# Altium project RegistrationModule.PrjPCB (part 2 of 4)

## Sheet DigitalPart.SchDoc: Плата АЦП - общая часть
size 330 x 381 mm; PageSetup: Record=PageOptions|CenterHorizontal=True|CenterVertical=True|PrintScale=0.82|XCorrection=1.00|YCorrection=1.00|PrintKind=2|BorderSize=5000000|LeftOffset=0|BottomOffset=0|Orientation=1|PaperLength=1000|PaperWidth=1000|Scale=100|PaperSource=7|PrintQuality=-4|MediaType=1|DitherType=10|PaperKind=A3|PrintScaleMode=1
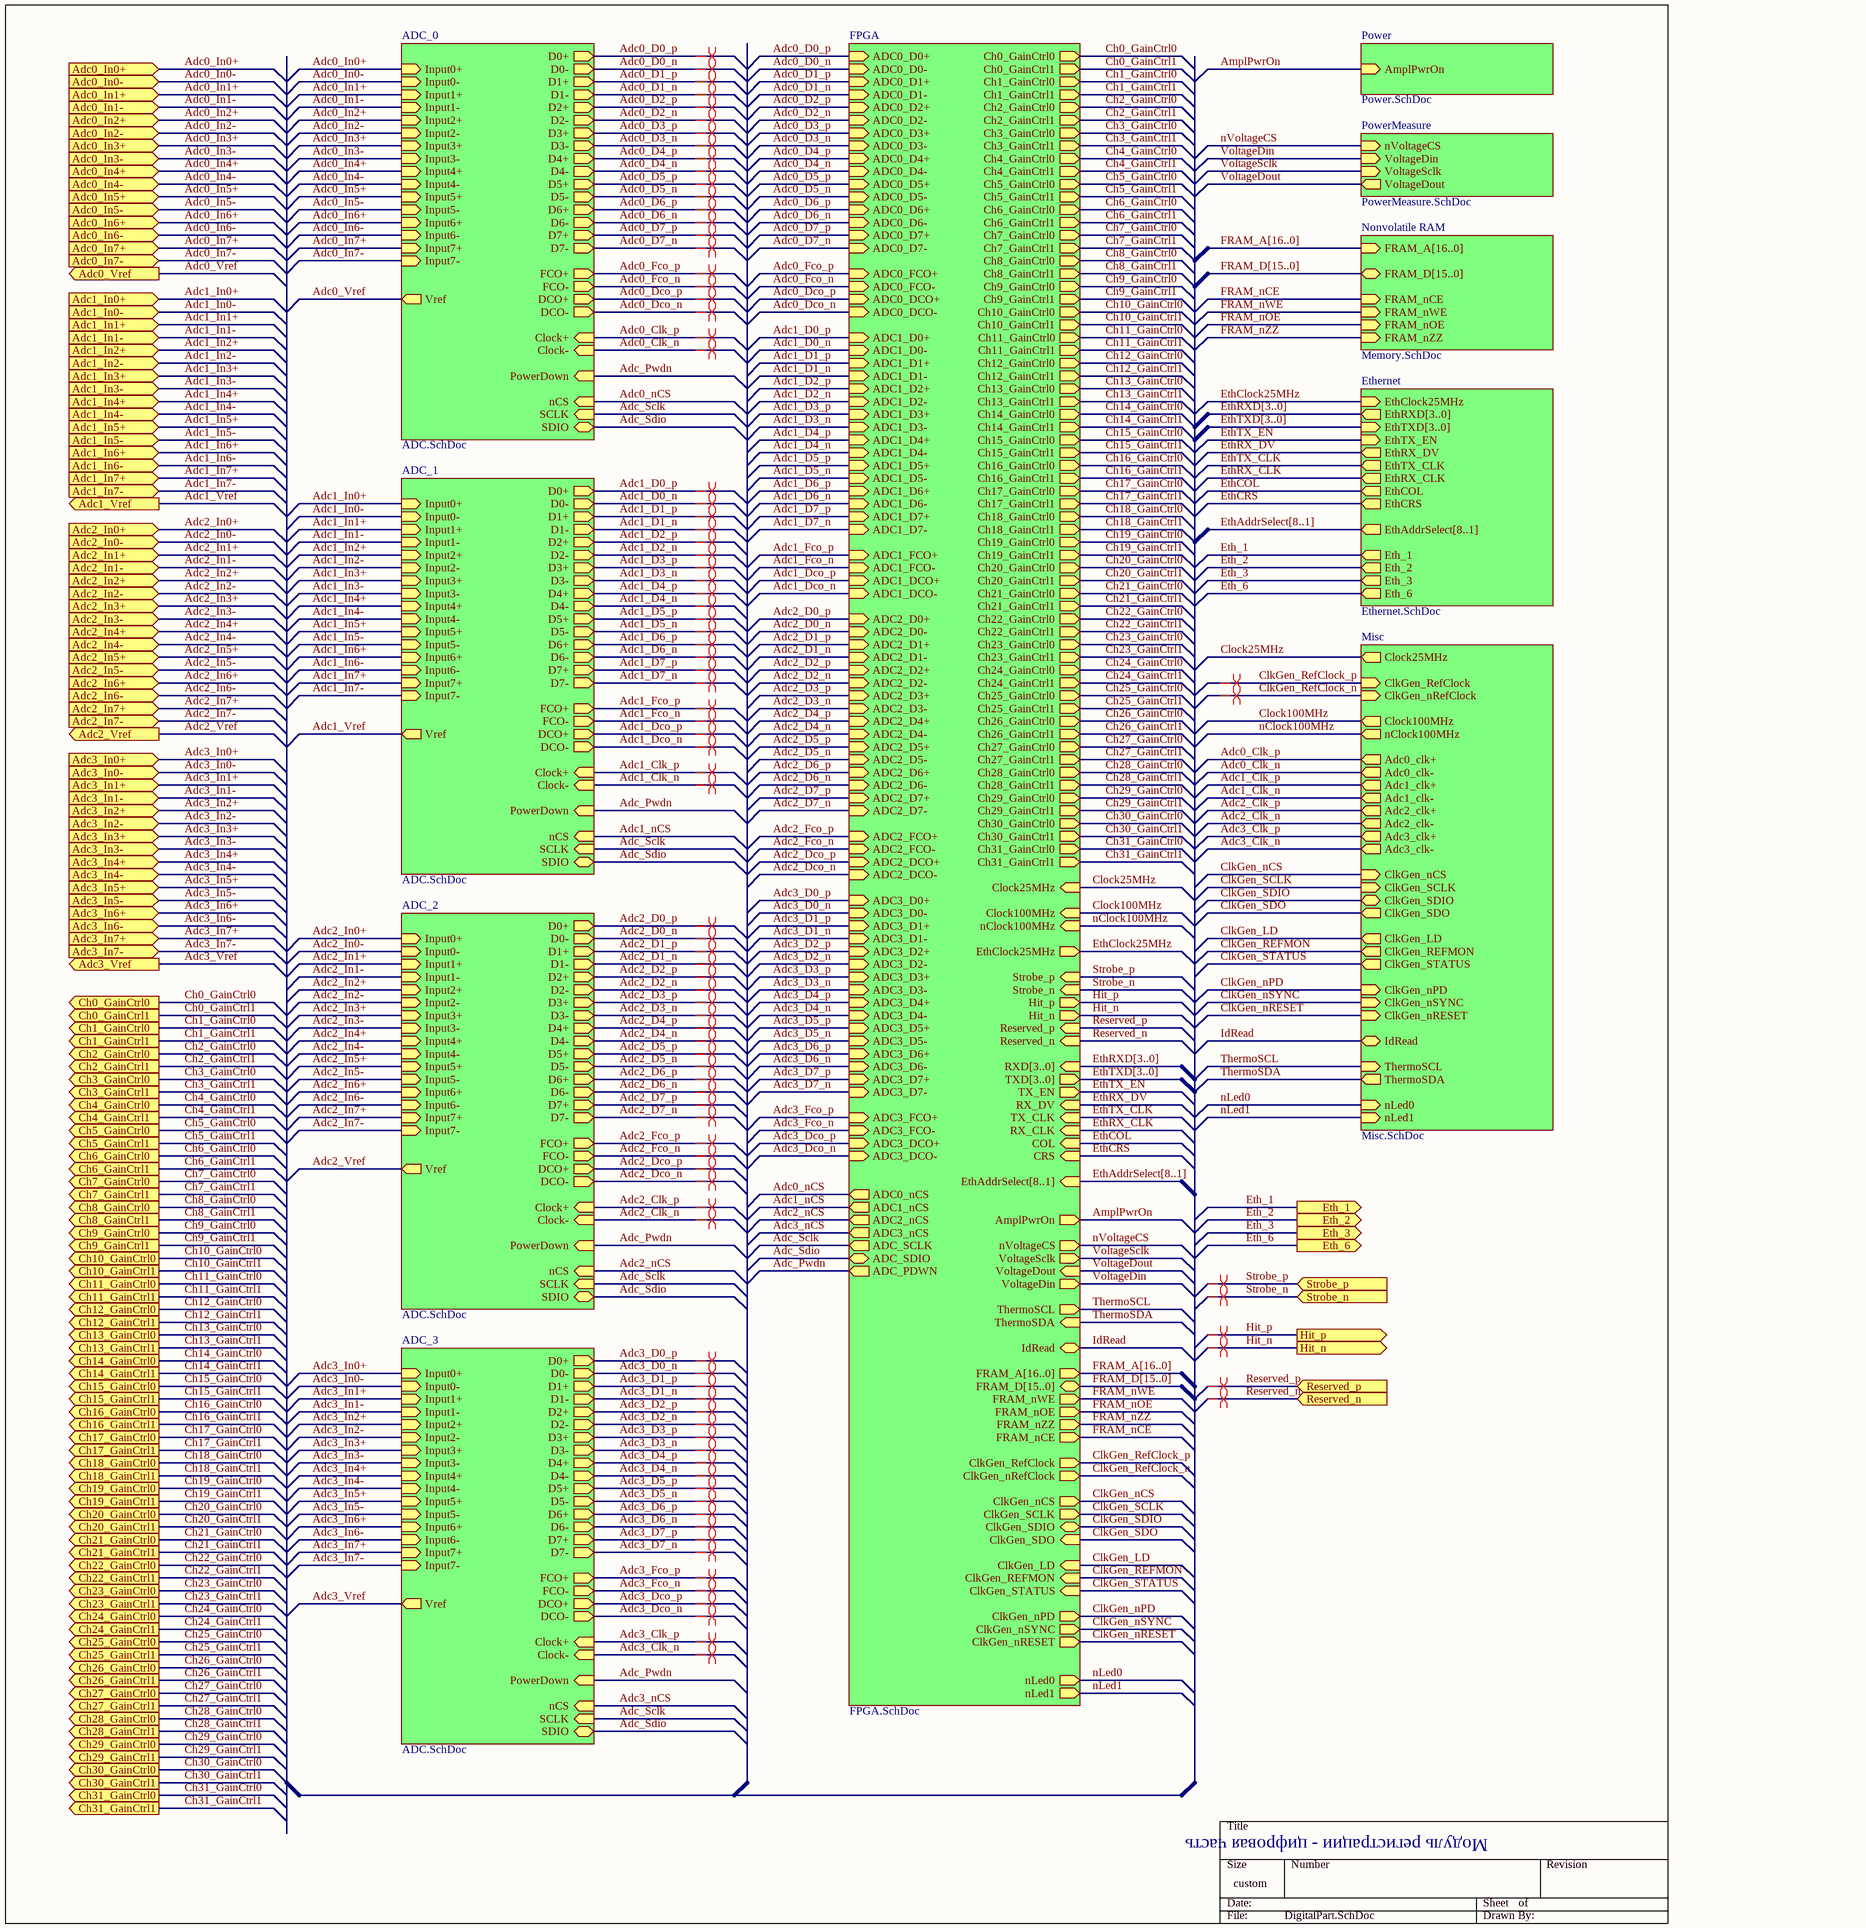
[diagram p1: DigitalPart.SchDoc]

### Sub-sheets
ADC_0 = ADC.SchDoc: Input3+ (in), Input3- (in), Input2- (in), Input2+ (in), Input1+ (in), Input1- (in), Input0- (in), Input0+ (in), Input4- (in), Input4+ (in), Input5+ (in), Input5- (in), Input6- (in), Input6+ (in), Input7+ (in), Input7- (in), PowerDown (in), D0+ (out), D0- (out), D1+ (out), D1- (out), D2+ (out), D2- (out), D3+ (out), D3- (out), FCO+ (out), FCO- (out), DCO+ (out), DCO- (out), D4+ (out), D4- (out), D5+ (out), D5- (out), D6+ (out), D6- (out), D7+ (out), D7- (out), Clock+ (in), Clock- (in), Vref (out), nCS (in), SDIO (bidir), SCLK (in)
ADC_1 = ADC.SchDoc: Input3+ (in), Input3- (in), Input2- (in), Input2+ (in), Input1+ (in), Input1- (in), Input0- (in), Input0+ (in), Input4- (in), Input4+ (in), Input5+ (in), Input5- (in), Input6- (in), Input6+ (in), Input7+ (in), Input7- (in), PowerDown (in), D0+ (out), D0- (out), D1+ (out), D1- (out), D2+ (out), D2- (out), D3+ (out), D3- (out), FCO+ (out), FCO- (out), DCO+ (out), DCO- (out), D4+ (out), D4- (out), D5+ (out), D5- (out), D6+ (out), D6- (out), D7+ (out), D7- (out), Clock+ (in), Clock- (in), Vref (out), nCS (in), SDIO (bidir), SCLK (in)
ADC_2 = ADC.SchDoc: Input3+ (in), Input3- (in), Input2- (in), Input2+ (in), Input1+ (in), Input1- (in), Input0- (in), Input0+ (in), Input4- (in), Input4+ (in), Input5+ (in), Input5- (in), Input6- (in), Input6+ (in), Input7+ (in), Input7- (in), PowerDown (in), D0+ (out), D0- (out), D1+ (out), D1- (out), D2+ (out), D2- (out), D3+ (out), D3- (out), FCO+ (out), FCO- (out), DCO+ (out), DCO- (out), D4+ (out), D4- (out), D5+ (out), D5- (out), D6+ (out), D6- (out), D7+ (out), D7- (out), Clock+ (in), Clock- (in), Vref (out), nCS (in), SDIO (bidir), SCLK (in)
ADC_3 = ADC.SchDoc: Input3+ (in), Input3- (in), Input2- (in), Input2+ (in), Input1+ (in), Input1- (in), Input0- (in), Input0+ (in), Input4- (in), Input4+ (in), Input5+ (in), Input5- (in), Input6- (in), Input6+ (in), Input7+ (in), Input7- (in), PowerDown (in), D0+ (out), D0- (out), D1+ (out), D1- (out), D2+ (out), D2- (out), D3+ (out), D3- (out), FCO+ (out), FCO- (out), DCO+ (out), DCO- (out), D4+ (out), D4- (out), D5+ (out), D5- (out), D6+ (out), D6- (out), D7+ (out), D7- (out), Clock+ (in), Clock- (in), Vref (out), nCS (in), SDIO (bidir), SCLK (in)
Ethernet = Ethernet.SchDoc: EthCOL (out), EthTX_EN (in), EthTX_CLK (out), EthRX_CLK (out), EthRX_DV (out), EthTXD[3..0] (in), EthRXD[3..0] (out), EthCRS (out), EthAddrSelect[8..1] (out), Eth_1 (out), Eth_2 (out), Eth_3 (out), Eth_6 (out), EthClock25MHz (in)
FPGA = FPGA.SchDoc: ADC0_D0+ (in), ADC0_D0- (in), ADC0_D1+ (in), ADC0_D2+ (in), ADC0_D3+ (in), ADC0_D4+ (in), ADC0_D5+ (in), ADC0_D6+ (in), ADC0_D7+ (in), ADC0_D1- (in), ADC0_D2- (in), ADC0_D3- (in), ADC0_D4- (in), ADC0_D5- (in), ADC0_D6- (in), ADC0_D7- (in), ADC0_DCO+ (in), ADC0_DCO- (in), ADC0_FCO+ (in), ADC0_FCO- (in), ADC1_D0+ (in), ADC1_D0- (in), ADC1_D1+ (in), ADC1_D2+ (in), ADC1_D3+ (in), ADC1_D4+ (in), ADC1_D5+ (in), ADC1_D6+ (in), ADC1_D7+ (in), ADC1_D1- (in), ADC1_D2- (in), ADC1_D3- (in), ADC1_D4- (in), ADC1_D5- (in), ADC1_D6- (in), ADC1_D7- (in), ADC1_DCO+ (in), ADC1_DCO- (in), ADC1_FCO+ (in), ADC1_FCO- (in), ADC_PDWN (out), ADC0_nCS (out), ADC1_nCS (out), ADC_SDIO (bidir), ADC_SCLK (out), AmplPwrOn (out), nVoltageCS (out), VoltageDin (out), VoltageSclk (out), VoltageDout (in), FRAM_A[16..0] (out), FRAM_nWE (out), FRAM_nOE (out), FRAM_nZZ (out), FRAM_nCE (out), FRAM_D[15..0] (bidir), IdRead (bidir), ThermoSDA (in), nClock100MHz (in), ThermoSCL (out), Strobe_n (in), ADC2_D0+ (in), ADC2_D0- (in), ADC2_D1+ (in), ADC2_D2+ (in), ADC2_D3+ (in), ADC2_D4+ (in), ADC2_D5+ (in), ADC2_D6+ (in), ADC2_D7+ (in), ADC2_D1- (in), ADC2_D2- (in), ADC2_D3- (in), ADC2_D4- (in), ADC2_D5- (in), ADC2_D6- (in), ADC2_D7- (in), ADC2_DCO+ (in), ADC2_DCO- (in), ADC2_FCO+ (in), ADC2_FCO- (in), ADC3_D0+ (in), ADC3_D0- (in), ADC3_D1+ (in), ADC3_D2+ (in), ADC3_D3+ (in), ADC3_D4+ (in), ADC3_D5+ (in), ADC3_D6+ (in), ADC3_D7+ (in), ADC3_D1- (in), ADC3_D2- (in), ADC3_D3- (in), ADC3_D4- (in), ADC3_D5- (in), ADC3_D6- (in), ADC3_D7- (in), ADC3_DCO+ (in), ADC3_DCO- (in), ADC3_FCO+ (in), ADC3_FCO- (in), ADC2_nCS (out), ADC3_nCS (out), Clock100MHz (in), Clock25MHz (in), Strobe_p (in), Hit_p (out), Hit_n (out), Reserved_p (in), Reserved_n (in), COL (in), TX_EN (out), TX_CLK (in), RX_CLK (in), RX_DV (in), TXD[3..0] (out), CRS (in), RXD[3..0] (in), EthAddrSelect[8..1] (in), Ch0_GainCtrl0 (out), Ch1_GainCtrl0 (out), Ch2_GainCtrl0 (out), Ch3_GainCtrl0 (out), Ch4_GainCtrl0 (out), Ch5_GainCtrl0 (out), Ch6_GainCtrl0 (out), Ch7_GainCtrl0 (out), Ch8_GainCtrl0 (out), Ch9_GainCtrl0 (out), Ch10_GainCtrl0 (out), Ch11_GainCtrl0 (out), Ch12_GainCtrl0 (out), Ch13_GainCtrl0 (out), Ch14_GainCtrl0 (out), Ch15_GainCtrl0 (out), Ch16_GainCtrl0 (out), Ch17_GainCtrl0 (out), Ch18_GainCtrl0 (out), Ch19_GainCtrl0 (out), Ch20_GainCtrl0 (out), Ch21_GainCtrl0 (out), Ch22_GainCtrl0 (out), Ch23_GainCtrl0 (out), Ch24_GainCtrl0 (out), Ch25_GainCtrl0 (out), Ch26_GainCtrl0 (out), Ch27_GainCtrl0 (out), Ch28_GainCtrl0 (out), Ch29_GainCtrl0 (out), Ch30_GainCtrl0 (out), Ch31_GainCtrl0 (out), Ch0_GainCtrl1 (out), Ch1_GainCtrl1 (out), Ch2_GainCtrl1 (out), Ch3_GainCtrl1 (out), Ch4_GainCtrl1 (out), Ch5_GainCtrl1 (out), Ch6_GainCtrl1 (out), Ch7_GainCtrl1 (out), Ch8_GainCtrl1 (out), Ch9_GainCtrl1 (out), Ch10_GainCtrl1 (out), Ch11_GainCtrl1 (out), Ch12_GainCtrl1 (out), Ch13_GainCtrl1 (out), Ch14_GainCtrl1 (out), Ch15_GainCtrl1 (out), Ch16_GainCtrl1 (out), Ch17_GainCtrl1 (out), Ch18_GainCtrl1 (out), Ch19_GainCtrl1 (out), Ch20_GainCtrl1 (out), Ch21_GainCtrl1 (out), Ch22_GainCtrl1 (out), Ch23_GainCtrl1 (out), Ch24_GainCtrl1 (out), Ch25_GainCtrl1 (out), Ch26_GainCtrl1 (out), Ch27_GainCtrl1 (out), Ch28_GainCtrl1 (out), Ch29_GainCtrl1 (out), Ch30_GainCtrl1 (out), Ch31_GainCtrl1 (out), EthClock25MHz (out), ClkGen_RefClock (out), ClkGen_nRefClock (out), ClkGen_SCLK (out), ClkGen_SDIO (bidir), ClkGen_SDO (in), ClkGen_nCS (out), ClkGen_nPD (out), ClkGen_nSYNC (out), ClkGen_nRESET (out), ClkGen_LD (in), ClkGen_REFMON (in), ClkGen_STATUS (in), nLed0 (out), nLed1 (out)
Misc = Misc.SchDoc: IdRead (bidir), ThermoSDA (out), ThermoSCL (in), Clock25MHz (out), Adc0_clk+ (out), Adc0_clk- (out), Adc1_clk+ (out), Adc1_clk- (out), Adc2_clk+ (out), Adc2_clk- (out), Adc3_clk+ (out), Adc3_clk- (out), Clock100MHz (out), nClock100MHz (out), ClkGen_RefClock (in), ClkGen_nRefClock (in), ClkGen_SCLK (in), ClkGen_SDIO (bidir), ClkGen_SDO (out), ClkGen_nCS (in), ClkGen_LD (out), ClkGen_REFMON (out), ClkGen_STATUS (out), ClkGen_nPD (in), ClkGen_nSYNC (in), ClkGen_nRESET (in), nLed0 (in), nLed1 (in)
Nonvolatile RAM = Memory.SchDoc: FRAM_A[16..0] (in), FRAM_nWE (in), FRAM_nOE (in), FRAM_nZZ (in), FRAM_D[15..0] (bidir), FRAM_nCE (in)
Power = Power.SchDoc: AmplPwrOn (in)
PowerMeasure = PowerMeasure.SchDoc: nVoltageCS (in), VoltageDin (in), VoltageSclk (in), VoltageDout (out)

### Ports
Adc0_In0+ (in), Adc0_In0- (in), Adc0_In1+ (in), Adc0_In1- (in), Adc0_In2+ (in), Adc0_In2- (in), Adc0_In3+ (in), Adc0_In3- (in), Adc0_In4+ (in), Adc0_In4- (in), Adc0_In5+ (in), Adc0_In5- (in), Adc0_In6+ (in), Adc0_In6- (in), Adc0_In7+ (in), Adc0_In7- (in), Adc0_Vref (out), Adc1_In0+ (in), Adc1_In0- (in), Adc1_In1+ (in), Adc1_In1- (in), Adc1_In2+ (in), Adc1_In2- (in), Adc1_In3+ (in), Adc1_In3- (in), Adc1_In4+ (in), Adc1_In4- (in), Adc1_In5+ (in), Adc1_In5- (in), Adc1_In6+ (in), Adc1_In6- (in), Adc1_In7+ (in), Adc1_In7- (in), Adc1_Vref (out), Adc2_In0+ (in), Adc2_In0- (in), Adc2_In1+ (in), Adc2_In1- (in), Adc2_In2+ (in), Adc2_In2- (in), Adc2_In3+ (in), Adc2_In3- (in), Adc2_In4+ (in), Adc2_In4- (in), Adc2_In5+ (in), Adc2_In5- (in), Adc2_In6+ (in), Adc2_In6- (in), Adc2_In7+ (in), Adc2_In7- (in), Adc2_Vref (out), Adc3_In0+ (in), Adc3_In0- (in), Adc3_In1+ (in), Adc3_In1- (in), Adc3_In2+ (in), Adc3_In2- (in), Adc3_In3+ (in), Adc3_In3- (in), Adc3_In4+ (in), Adc3_In4- (in), Adc3_In5+ (in), Adc3_In5- (in), Adc3_In6+ (in), Adc3_In6- (in), Adc3_In7+ (in), Adc3_In7- (in), Adc3_Vref (out), Ch0_GainCtrl0 (out), Ch0_GainCtrl1 (out), Ch1_GainCtrl0 (out), Ch1_GainCtrl1 (out), Ch2_GainCtrl0 (out), Ch2_GainCtrl1 (out), Ch3_GainCtrl0 (out), Ch3_GainCtrl1 (out), Ch4_GainCtrl0 (out), Ch4_GainCtrl1 (out), Ch5_GainCtrl0 (out), Ch5_GainCtrl1 (out), Ch6_GainCtrl0 (out), Ch6_GainCtrl1 (out), Ch7_GainCtrl0 (out), Ch7_GainCtrl1 (out), Ch8_GainCtrl0 (out), Ch8_GainCtrl1 (out), Ch9_GainCtrl0 (out), Ch9_GainCtrl1 (out), Ch10_GainCtrl0 (out), Ch10_GainCtrl1 (out), Ch11_GainCtrl0 (out), Ch11_GainCtrl1 (out), Ch12_GainCtrl0 (out), Ch12_GainCtrl1 (out), Ch13_GainCtrl0 (out), Ch13_GainCtrl1 (out), Ch14_GainCtrl0 (out), Ch14_GainCtrl1 (out), Ch15_GainCtrl0 (out), Ch15_GainCtrl1 (out), Ch16_GainCtrl0 (out), Ch16_GainCtrl1 (out), Ch17_GainCtrl0 (out), Ch17_GainCtrl1 (out), Ch18_GainCtrl0 (out), Ch18_GainCtrl1 (out), Ch19_GainCtrl0 (out), Ch19_GainCtrl1 (out), Ch20_GainCtrl0 (out), Ch20_GainCtrl1 (out), Ch21_GainCtrl0 (out), Ch21_GainCtrl1 (out), Ch22_GainCtrl0 (out), Ch22_GainCtrl1 (out), Ch23_GainCtrl0 (out), Ch23_GainCtrl1 (out), Ch24_GainCtrl0 (out), Ch24_GainCtrl1 (out), Ch25_GainCtrl0 (out), Ch25_GainCtrl1 (out), Ch26_GainCtrl0 (out), Ch26_GainCtrl1 (out), Ch27_GainCtrl0 (out), Ch27_GainCtrl1 (out), Ch28_GainCtrl0 (out), Ch28_GainCtrl1 (out), Ch29_GainCtrl0 (out), Ch29_GainCtrl1 (out), Ch30_GainCtrl0 (out), Ch30_GainCtrl1 (out), Ch31_GainCtrl0 (out), Ch31_GainCtrl1 (out), Eth_1 (out), Eth_2 (out), Eth_3 (out), Eth_6 (out), Hit_n (out), Hit_p (out), Reserved_n (in), Reserved_p (in), Strobe_n (in), Strobe_p (in)

### Nets
Adc0_Clk_n: sheet Misc/Adc0_clk-, sheet ADC_0/Clock-
Adc0_Clk_p: sheet Misc/Adc0_clk+, sheet ADC_0/Clock+
Adc0_D0_n: sheet ADC_0/D0-, sheet FPGA/ADC0_D0-
Adc0_D0_p: sheet ADC_0/D0+, sheet FPGA/ADC0_D0+
Adc0_D1_n: sheet ADC_0/D1-, sheet FPGA/ADC0_D1-
Adc0_D1_p: sheet ADC_0/D1+, sheet FPGA/ADC0_D1+
Adc0_D2_n: sheet ADC_0/D2-, sheet FPGA/ADC0_D2-
Adc0_D2_p: sheet ADC_0/D2+, sheet FPGA/ADC0_D2+
Adc0_D3_n: sheet ADC_0/D3-, sheet FPGA/ADC0_D3-
Adc0_D3_p: sheet ADC_0/D3+, sheet FPGA/ADC0_D3+
Adc0_D4_n: sheet ADC_0/D4-, sheet FPGA/ADC0_D4-
Adc0_D4_p: sheet ADC_0/D4+, sheet FPGA/ADC0_D4+
Adc0_D5_n: sheet ADC_0/D5-, sheet FPGA/ADC0_D5-
Adc0_D5_p: sheet ADC_0/D5+, sheet FPGA/ADC0_D5+
Adc0_D6_n: sheet ADC_0/D6-, sheet FPGA/ADC0_D6-
Adc0_D6_p: sheet ADC_0/D6+, sheet FPGA/ADC0_D6+
Adc0_D7_n: sheet ADC_0/D7-, sheet FPGA/ADC0_D7-
Adc0_D7_p: sheet ADC_0/D7+, sheet FPGA/ADC0_D7+
Adc0_Dco_n: sheet ADC_0/DCO-, sheet FPGA/ADC0_DCO-
Adc0_Dco_p: sheet ADC_0/DCO+, sheet FPGA/ADC0_DCO+
Adc0_Fco_n: sheet ADC_0/FCO-, sheet FPGA/ADC0_FCO-
Adc0_Fco_p: sheet ADC_0/FCO+, sheet FPGA/ADC0_FCO+
Adc0_In0+: port Adc0_In0+, sheet ADC_0/Input0+
Adc0_In0-: port Adc0_In0-, sheet ADC_0/Input0-
Adc0_In1+: port Adc0_In1+, sheet ADC_0/Input1+
Adc0_In1-: port Adc0_In1-, sheet ADC_0/Input1-
Adc0_In2+: port Adc0_In2+, sheet ADC_0/Input2+
Adc0_In2-: port Adc0_In2-, sheet ADC_0/Input2-
Adc0_In3+: port Adc0_In3+, sheet ADC_0/Input3+
Adc0_In3-: port Adc0_In3-, sheet ADC_0/Input3-
Adc0_In4+: port Adc0_In4+, sheet ADC_0/Input4+
Adc0_In4-: port Adc0_In4-, sheet ADC_0/Input4-
Adc0_In5+: port Adc0_In5+, sheet ADC_0/Input5+
Adc0_In5-: port Adc0_In5-, sheet ADC_0/Input5-
Adc0_In6+: port Adc0_In6+, sheet ADC_0/Input6+
Adc0_In6-: port Adc0_In6-, sheet ADC_0/Input6-
Adc0_In7+: port Adc0_In7+, sheet ADC_0/Input7+
Adc0_In7-: port Adc0_In7-, sheet ADC_0/Input7-
Adc0_nCS: sheet ADC_0/nCS, sheet FPGA/ADC0_nCS
Adc0_Vref: port Adc0_Vref, sheet ADC_0/Vref
Adc1_Clk_n: sheet Misc/Adc1_clk-, sheet ADC_1/Clock-
Adc1_Clk_p: sheet Misc/Adc1_clk+, sheet ADC_1/Clock+
Adc1_D0_n: sheet ADC_1/D0-, sheet FPGA/ADC1_D0-
Adc1_D0_p: sheet ADC_1/D0+, sheet FPGA/ADC1_D0+
Adc1_D1_n: sheet ADC_1/D1-, sheet FPGA/ADC1_D1-
Adc1_D1_p: sheet ADC_1/D1+, sheet FPGA/ADC1_D1+
Adc1_D2_n: sheet ADC_1/D2-, sheet FPGA/ADC1_D2-
Adc1_D2_p: sheet ADC_1/D2+, sheet FPGA/ADC1_D2+
Adc1_D3_n: sheet ADC_1/D3-, sheet FPGA/ADC1_D3-
Adc1_D3_p: sheet ADC_1/D3+, sheet FPGA/ADC1_D3+
Adc1_D4_n: sheet ADC_1/D4-, sheet FPGA/ADC1_D4-
Adc1_D4_p: sheet ADC_1/D4+, sheet FPGA/ADC1_D4+
Adc1_D5_n: sheet ADC_1/D5-, sheet FPGA/ADC1_D5-
Adc1_D5_p: sheet ADC_1/D5+, sheet FPGA/ADC1_D5+
Adc1_D6_n: sheet ADC_1/D6-, sheet FPGA/ADC1_D6-
Adc1_D6_p: sheet ADC_1/D6+, sheet FPGA/ADC1_D6+
Adc1_D7_n: sheet ADC_1/D7-, sheet FPGA/ADC1_D7-
Adc1_D7_p: sheet ADC_1/D7+, sheet FPGA/ADC1_D7+
Adc1_Dco_n: sheet ADC_1/DCO-, sheet FPGA/ADC1_DCO-
Adc1_Dco_p: sheet ADC_1/DCO+, sheet FPGA/ADC1_DCO+
Adc1_Fco_n: sheet ADC_1/FCO-, sheet FPGA/ADC1_FCO-
Adc1_Fco_p: sheet ADC_1/FCO+, sheet FPGA/ADC1_FCO+
Adc1_In0+: port Adc1_In0+, sheet ADC_1/Input0+
Adc1_In0-: port Adc1_In0-, sheet ADC_1/Input0-
Adc1_In1+: port Adc1_In1+, sheet ADC_1/Input1+
Adc1_In1-: port Adc1_In1-, sheet ADC_1/Input1-
Adc1_In2+: port Adc1_In2+, sheet ADC_1/Input2+
Adc1_In2-: port Adc1_In2-, sheet ADC_1/Input2-
Adc1_In3+: port Adc1_In3+, sheet ADC_1/Input3+
Adc1_In3-: port Adc1_In3-, sheet ADC_1/Input3-
Adc1_In4+: port Adc1_In4+, sheet ADC_1/Input4+
Adc1_In4-: port Adc1_In4-, sheet ADC_1/Input4-
Adc1_In5+: port Adc1_In5+, sheet ADC_1/Input5+
Adc1_In5-: port Adc1_In5-, sheet ADC_1/Input5-
Adc1_In6+: port Adc1_In6+, sheet ADC_1/Input6+
Adc1_In6-: port Adc1_In6-, sheet ADC_1/Input6-
Adc1_In7+: port Adc1_In7+, sheet ADC_1/Input7+
Adc1_In7-: port Adc1_In7-, sheet ADC_1/Input7-
Adc1_nCS: sheet ADC_1/nCS, sheet FPGA/ADC1_nCS
Adc1_Vref: port Adc1_Vref, sheet ADC_1/Vref
Adc2_Clk_n: sheet Misc/Adc2_clk-, sheet ADC_2/Clock-
Adc2_Clk_p: sheet Misc/Adc2_clk+, sheet ADC_2/Clock+
Adc2_D0_n: sheet ADC_2/D0-, sheet FPGA/ADC2_D0-
Adc2_D0_p: sheet ADC_2/D0+, sheet FPGA/ADC2_D0+
Adc2_D1_n: sheet ADC_2/D1-, sheet FPGA/ADC2_D1-
Adc2_D1_p: sheet ADC_2/D1+, sheet FPGA/ADC2_D1+
Adc2_D2_n: sheet ADC_2/D2-, sheet FPGA/ADC2_D2-
Adc2_D2_p: sheet ADC_2/D2+, sheet FPGA/ADC2_D2+
Adc2_D3_n: sheet ADC_2/D3-, sheet FPGA/ADC2_D3-
Adc2_D3_p: sheet ADC_2/D3+, sheet FPGA/ADC2_D3+
Adc2_D4_n: sheet ADC_2/D4-, sheet FPGA/ADC2_D4-
Adc2_D4_p: sheet ADC_2/D4+, sheet FPGA/ADC2_D4+
Adc2_D5_n: sheet ADC_2/D5-, sheet FPGA/ADC2_D5-
Adc2_D5_p: sheet ADC_2/D5+, sheet FPGA/ADC2_D5+
Adc2_D6_n: sheet ADC_2/D6-, sheet FPGA/ADC2_D6-
Adc2_D6_p: sheet ADC_2/D6+, sheet FPGA/ADC2_D6+
Adc2_D7_n: sheet ADC_2/D7-, sheet FPGA/ADC2_D7-
Adc2_D7_p: sheet ADC_2/D7+, sheet FPGA/ADC2_D7+
Adc2_Dco_n: sheet ADC_2/DCO-, sheet FPGA/ADC2_DCO-
Adc2_Dco_p: sheet ADC_2/DCO+, sheet FPGA/ADC2_DCO+
Adc2_Fco_n: sheet ADC_2/FCO-, sheet FPGA/ADC2_FCO-
Adc2_Fco_p: sheet ADC_2/FCO+, sheet FPGA/ADC2_FCO+
Adc2_In0+: port Adc2_In0+, sheet ADC_2/Input0+
Adc2_In0-: port Adc2_In0-, sheet ADC_2/Input0-
Adc2_In1+: port Adc2_In1+, sheet ADC_2/Input1+
Adc2_In1-: port Adc2_In1-, sheet ADC_2/Input1-
Adc2_In2+: port Adc2_In2+, sheet ADC_2/Input2+
Adc2_In2-: port Adc2_In2-, sheet ADC_2/Input2-
Adc2_In3+: port Adc2_In3+, sheet ADC_2/Input3+
Adc2_In3-: port Adc2_In3-, sheet ADC_2/Input3-
Adc2_In4+: port Adc2_In4+, sheet ADC_2/Input4+
Adc2_In4-: port Adc2_In4-, sheet ADC_2/Input4-
Adc2_In5+: port Adc2_In5+, sheet ADC_2/Input5+
Adc2_In5-: port Adc2_In5-, sheet ADC_2/Input5-
Adc2_In6+: port Adc2_In6+, sheet ADC_2/Input6+
Adc2_In6-: port Adc2_In6-, sheet ADC_2/Input6-
Adc2_In7+: port Adc2_In7+, sheet ADC_2/Input7+
Adc2_In7-: port Adc2_In7-, sheet ADC_2/Input7-
Adc2_nCS: sheet ADC_2/nCS, sheet FPGA/ADC2_nCS
Adc2_Vref: port Adc2_Vref, sheet ADC_2/Vref
Adc3_Clk_n: sheet Misc/Adc3_clk-, sheet ADC_3/Clock-
Adc3_Clk_p: sheet Misc/Adc3_clk+, sheet ADC_3/Clock+
Adc3_D0_n: sheet ADC_3/D0-, sheet FPGA/ADC3_D0-
Adc3_D0_p: sheet ADC_3/D0+, sheet FPGA/ADC3_D0+
Adc3_D1_n: sheet ADC_3/D1-, sheet FPGA/ADC3_D1-
Adc3_D1_p: sheet ADC_3/D1+, sheet FPGA/ADC3_D1+
Adc3_D2_n: sheet ADC_3/D2-, sheet FPGA/ADC3_D2-
Adc3_D2_p: sheet ADC_3/D2+, sheet FPGA/ADC3_D2+
Adc3_D3_n: sheet ADC_3/D3-, sheet FPGA/ADC3_D3-
Adc3_D3_p: sheet ADC_3/D3+, sheet FPGA/ADC3_D3+
Adc3_D4_n: sheet ADC_3/D4-, sheet FPGA/ADC3_D4-
Adc3_D4_p: sheet ADC_3/D4+, sheet FPGA/ADC3_D4+
Adc3_D5_n: sheet ADC_3/D5-, sheet FPGA/ADC3_D5-
Adc3_D5_p: sheet ADC_3/D5+, sheet FPGA/ADC3_D5+
Adc3_D6_n: sheet ADC_3/D6-, sheet FPGA/ADC3_D6-
Adc3_D6_p: sheet ADC_3/D6+, sheet FPGA/ADC3_D6+
Adc3_D7_n: sheet ADC_3/D7-, sheet FPGA/ADC3_D7-
Adc3_D7_p: sheet ADC_3/D7+, sheet FPGA/ADC3_D7+
Adc3_Dco_n: sheet ADC_3/DCO-, sheet FPGA/ADC3_DCO-
Adc3_Dco_p: sheet ADC_3/DCO+, sheet FPGA/ADC3_DCO+
Adc3_Fco_n: sheet ADC_3/FCO-, sheet FPGA/ADC3_FCO-
Adc3_Fco_p: sheet ADC_3/FCO+, sheet FPGA/ADC3_FCO+
Adc3_In0+: port Adc3_In0+, sheet ADC_3/Input0+
Adc3_In0-: port Adc3_In0-, sheet ADC_3/Input0-
Adc3_In1+: port Adc3_In1+, sheet ADC_3/Input1+
Adc3_In1-: port Adc3_In1-, sheet ADC_3/Input1-
Adc3_In2+: port Adc3_In2+, sheet ADC_3/Input2+
Adc3_In2-: port Adc3_In2-, sheet ADC_3/Input2-
Adc3_In3+: port Adc3_In3+, sheet ADC_3/Input3+
Adc3_In3-: port Adc3_In3-, sheet ADC_3/Input3-
Adc3_In4+: port Adc3_In4+, sheet ADC_3/Input4+
Adc3_In4-: port Adc3_In4-, sheet ADC_3/Input4-
Adc3_In5+: port Adc3_In5+, sheet ADC_3/Input5+
Adc3_In5-: port Adc3_In5-, sheet ADC_3/Input5-
Adc3_In6+: port Adc3_In6+, sheet ADC_3/Input6+
Adc3_In6-: port Adc3_In6-, sheet ADC_3/Input6-
Adc3_In7+: port Adc3_In7+, sheet ADC_3/Input7+
Adc3_In7-: port Adc3_In7-, sheet ADC_3/Input7-
Adc3_nCS: sheet ADC_3/nCS, sheet FPGA/ADC3_nCS
Adc3_Vref: port Adc3_Vref, sheet ADC_3/Vref
Adc_Pwdn: sheet ADC_0/PowerDown, sheet ADC_1/PowerDown, sheet ADC_2/PowerDown, sheet ADC_3/PowerDown, sheet FPGA/ADC_PDWN  [project net Adc_Pdwn]
Adc_Sclk: sheet ADC_0/SCLK, sheet ADC_1/SCLK, sheet ADC_2/SCLK, sheet ADC_3/SCLK, sheet FPGA/ADC_SCLK
Adc_Sdio: sheet ADC_0/SDIO, sheet ADC_1/SDIO, sheet ADC_2/SDIO, sheet ADC_3/SDIO, sheet FPGA/ADC_SDIO
AmplPwrOn: sheet Power/AmplPwrOn, sheet FPGA/AmplPwrOn
Ch0_GainCtrl0: port Ch0_GainCtrl0, sheet FPGA/Ch0_GainCtrl0
Ch0_GainCtrl1: port Ch0_GainCtrl1, sheet FPGA/Ch0_GainCtrl1
Ch1_GainCtrl0: port Ch1_GainCtrl0, sheet FPGA/Ch1_GainCtrl0
Ch1_GainCtrl1: port Ch1_GainCtrl1, sheet FPGA/Ch1_GainCtrl1
Ch2_GainCtrl0: port Ch2_GainCtrl0, sheet FPGA/Ch2_GainCtrl0
Ch2_GainCtrl1: port Ch2_GainCtrl1, sheet FPGA/Ch2_GainCtrl1
Ch3_GainCtrl0: port Ch3_GainCtrl0, sheet FPGA/Ch3_GainCtrl0
Ch3_GainCtrl1: port Ch3_GainCtrl1, sheet FPGA/Ch3_GainCtrl1
Ch4_GainCtrl0: port Ch4_GainCtrl0, sheet FPGA/Ch4_GainCtrl0
Ch4_GainCtrl1: port Ch4_GainCtrl1, sheet FPGA/Ch4_GainCtrl1
Ch5_GainCtrl0: port Ch5_GainCtrl0, sheet FPGA/Ch5_GainCtrl0
Ch5_GainCtrl1: port Ch5_GainCtrl1, sheet FPGA/Ch5_GainCtrl1
Ch6_GainCtrl0: port Ch6_GainCtrl0, sheet FPGA/Ch6_GainCtrl0
Ch6_GainCtrl1: port Ch6_GainCtrl1, sheet FPGA/Ch6_GainCtrl1
Ch7_GainCtrl0: port Ch7_GainCtrl0, sheet FPGA/Ch7_GainCtrl0
Ch7_GainCtrl1: port Ch7_GainCtrl1, sheet FPGA/Ch7_GainCtrl1
Ch8_GainCtrl0: port Ch8_GainCtrl0, sheet FPGA/Ch8_GainCtrl0
Ch8_GainCtrl1: port Ch8_GainCtrl1, sheet FPGA/Ch8_GainCtrl1
Ch9_GainCtrl0: port Ch9_GainCtrl0, sheet FPGA/Ch9_GainCtrl0
Ch9_GainCtrl1: port Ch9_GainCtrl1, sheet FPGA/Ch9_GainCtrl1
Ch10_GainCtrl0: port Ch10_GainCtrl0, sheet FPGA/Ch10_GainCtrl0
Ch10_GainCtrl1: port Ch10_GainCtrl1, sheet FPGA/Ch10_GainCtrl1
Ch11_GainCtrl0: port Ch11_GainCtrl0, sheet FPGA/Ch11_GainCtrl0
Ch11_GainCtrl1: port Ch11_GainCtrl1, sheet FPGA/Ch11_GainCtrl1
Ch12_GainCtrl0: port Ch12_GainCtrl0, sheet FPGA/Ch12_GainCtrl0
Ch12_GainCtrl1: port Ch12_GainCtrl1, sheet FPGA/Ch12_GainCtrl1
Ch13_GainCtrl0: port Ch13_GainCtrl0, sheet FPGA/Ch13_GainCtrl0
Ch13_GainCtrl1: port Ch13_GainCtrl1, sheet FPGA/Ch13_GainCtrl1
Ch14_GainCtrl0: port Ch14_GainCtrl0, sheet FPGA/Ch14_GainCtrl0
Ch14_GainCtrl1: port Ch14_GainCtrl1, sheet FPGA/Ch14_GainCtrl1
Ch15_GainCtrl0: port Ch15_GainCtrl0, sheet FPGA/Ch15_GainCtrl0
Ch15_GainCtrl1: port Ch15_GainCtrl1, sheet FPGA/Ch15_GainCtrl1
Ch16_GainCtrl0: port Ch16_GainCtrl0, sheet FPGA/Ch16_GainCtrl0
Ch16_GainCtrl1: port Ch16_GainCtrl1, sheet FPGA/Ch16_GainCtrl1
Ch17_GainCtrl0: port Ch17_GainCtrl0, sheet FPGA/Ch17_GainCtrl0
Ch17_GainCtrl1: port Ch17_GainCtrl1, sheet FPGA/Ch17_GainCtrl1
Ch18_GainCtrl0: port Ch18_GainCtrl0, sheet FPGA/Ch18_GainCtrl0
Ch18_GainCtrl1: port Ch18_GainCtrl1, sheet FPGA/Ch18_GainCtrl1
Ch19_GainCtrl0: port Ch19_GainCtrl0, sheet FPGA/Ch19_GainCtrl0
Ch19_GainCtrl1: port Ch19_GainCtrl1, sheet FPGA/Ch19_GainCtrl1
Ch20_GainCtrl0: port Ch20_GainCtrl0, sheet FPGA/Ch20_GainCtrl0
Ch20_GainCtrl1: port Ch20_GainCtrl1, sheet FPGA/Ch20_GainCtrl1
Ch21_GainCtrl0: port Ch21_GainCtrl0, sheet FPGA/Ch21_GainCtrl0
Ch21_GainCtrl1: port Ch21_GainCtrl1, sheet FPGA/Ch21_GainCtrl1
Ch22_GainCtrl0: port Ch22_GainCtrl0, sheet FPGA/Ch22_GainCtrl0
Ch22_GainCtrl1: port Ch22_GainCtrl1, sheet FPGA/Ch22_GainCtrl1
Ch23_GainCtrl0: port Ch23_GainCtrl0, sheet FPGA/Ch23_GainCtrl0
Ch23_GainCtrl1: port Ch23_GainCtrl1, sheet FPGA/Ch23_GainCtrl1
Ch24_GainCtrl0: port Ch24_GainCtrl0, sheet FPGA/Ch24_GainCtrl0
Ch24_GainCtrl1: port Ch24_GainCtrl1, sheet FPGA/Ch24_GainCtrl1
Ch25_GainCtrl0: port Ch25_GainCtrl0, sheet FPGA/Ch25_GainCtrl0
Ch25_GainCtrl1: port Ch25_GainCtrl1, sheet FPGA/Ch25_GainCtrl1
Ch26_GainCtrl0: port Ch26_GainCtrl0, sheet FPGA/Ch26_GainCtrl0
Ch26_GainCtrl1: port Ch26_GainCtrl1, sheet FPGA/Ch26_GainCtrl1
Ch27_GainCtrl0: port Ch27_GainCtrl0, sheet FPGA/Ch27_GainCtrl0
Ch27_GainCtrl1: port Ch27_GainCtrl1, sheet FPGA/Ch27_GainCtrl1
Ch28_GainCtrl0: port Ch28_GainCtrl0, sheet FPGA/Ch28_GainCtrl0
Ch28_GainCtrl1: port Ch28_GainCtrl1, sheet FPGA/Ch28_GainCtrl1
Ch29_GainCtrl0: port Ch29_GainCtrl0, sheet FPGA/Ch29_GainCtrl0
Ch29_GainCtrl1: port Ch29_GainCtrl1, sheet FPGA/Ch29_GainCtrl1
Ch30_GainCtrl0: port Ch30_GainCtrl0, sheet FPGA/Ch30_GainCtrl0
Ch30_GainCtrl1: port Ch30_GainCtrl1, sheet FPGA/Ch30_GainCtrl1
Ch31_GainCtrl0: port Ch31_GainCtrl0, sheet FPGA/Ch31_GainCtrl0
Ch31_GainCtrl1: port Ch31_GainCtrl1, sheet FPGA/Ch31_GainCtrl1
ClkGen_LD: sheet Misc/ClkGen_LD, sheet FPGA/ClkGen_LD
ClkGen_nCS: sheet Misc/ClkGen_nCS, sheet FPGA/ClkGen_nCS
ClkGen_nPD: sheet Misc/ClkGen_nPD, sheet FPGA/ClkGen_nPD
ClkGen_nRESET: sheet Misc/ClkGen_nRESET, sheet FPGA/ClkGen_nRESET
ClkGen_nSYNC: sheet Misc/ClkGen_nSYNC, sheet FPGA/ClkGen_nSYNC
ClkGen_RefClock_n: sheet Misc/ClkGen_nRefClock, sheet FPGA/ClkGen_nRefClock
ClkGen_RefClock_p: sheet Misc/ClkGen_RefClock, sheet FPGA/ClkGen_RefClock
ClkGen_REFMON: sheet Misc/ClkGen_REFMON, sheet FPGA/ClkGen_REFMON
ClkGen_SCLK: sheet Misc/ClkGen_SCLK, sheet FPGA/ClkGen_SCLK
ClkGen_SDIO: sheet Misc/ClkGen_SDIO, sheet FPGA/ClkGen_SDIO
ClkGen_SDO: sheet Misc/ClkGen_SDO, sheet FPGA/ClkGen_SDO
ClkGen_STATUS: sheet Misc/ClkGen_STATUS, sheet FPGA/ClkGen_STATUS
Clock25MHz: sheet Misc/Clock25MHz, sheet FPGA/Clock25MHz
Clock100MHz: sheet Misc/Clock100MHz, sheet FPGA/Clock100MHz
Eth_1: port Eth_1, sheet Ethernet/Eth_1
Eth_2: port Eth_2, sheet Ethernet/Eth_2
Eth_3: port Eth_3, sheet Ethernet/Eth_3
Eth_6: port Eth_6, sheet Ethernet/Eth_6
EthClock25MHz: sheet FPGA/EthClock25MHz, sheet Ethernet/EthClock25MHz
EthCOL: sheet FPGA/COL, sheet Ethernet/EthCOL
EthCRS: sheet FPGA/CRS, sheet Ethernet/EthCRS
EthRX_CLK: sheet FPGA/RX_CLK, sheet Ethernet/EthRX_CLK
EthRX_DV: sheet FPGA/RX_DV, sheet Ethernet/EthRX_DV
EthTX_CLK: sheet FPGA/TX_CLK, sheet Ethernet/EthTX_CLK
EthTX_EN: sheet FPGA/TX_EN, sheet Ethernet/EthTX_EN
FRAM_nCE: sheet Nonvolatile RAM/FRAM_nCE, sheet FPGA/FRAM_nCE
FRAM_nOE: sheet Nonvolatile RAM/FRAM_nOE, sheet FPGA/FRAM_nOE
FRAM_nWE: sheet Nonvolatile RAM/FRAM_nWE, sheet FPGA/FRAM_nWE
FRAM_nZZ: sheet Nonvolatile RAM/FRAM_nZZ, sheet FPGA/FRAM_nZZ
Hit_n: port Hit_n, sheet FPGA/Hit_n
Hit_p: port Hit_p, sheet FPGA/Hit_p
IdRead: sheet Misc/IdRead, sheet FPGA/IdRead
nClock100MHz: sheet Misc/nClock100MHz, sheet FPGA/nClock100MHz
nLed0: sheet Misc/nLed0, sheet FPGA/nLed0
nLed1: sheet Misc/nLed1, sheet FPGA/nLed1
nVoltageCS: sheet PowerMeasure/nVoltageCS, sheet FPGA/nVoltageCS
Reserved_n: port Reserved_n, sheet FPGA/Reserved_n
Reserved_p: port Reserved_p, sheet FPGA/Reserved_p
Strobe_n: port Strobe_n, sheet FPGA/Strobe_n
Strobe_p: port Strobe_p, sheet FPGA/Strobe_p
ThermoSCL: sheet Misc/ThermoSCL, sheet FPGA/ThermoSCL
ThermoSDA: sheet Misc/ThermoSDA, sheet FPGA/ThermoSDA
VoltageDin: sheet PowerMeasure/VoltageDin, sheet FPGA/VoltageDin
VoltageDout: sheet PowerMeasure/VoltageDout, sheet FPGA/VoltageDout
VoltageSclk: sheet PowerMeasure/VoltageSclk, sheet FPGA/VoltageSclk

### Buses and harness runs
bus EthAddrSelect[8..1] = sheet Ethernet/EthAddrSelect[8..1]
bus EthAddrSelect[8..1] = sheet FPGA/EthAddrSelect[8..1]
bus EthRXD[3..0] = sheet Ethernet/EthRXD[3..0]
bus EthRXD[3..0] = sheet FPGA/RXD[3..0]
bus EthTXD[3..0] = sheet Ethernet/EthTXD[3..0]
bus EthTXD[3..0] = sheet FPGA/TXD[3..0]
bus FRAM_A[16..0] = sheet FPGA/FRAM_A[16..0]
bus FRAM_A[16..0] = sheet Nonvolatile RAM/FRAM_A[16..0]
bus FRAM_D[15..0] = sheet FPGA/FRAM_D[15..0]
bus FRAM_D[15..0] = sheet Nonvolatile RAM/FRAM_D[15..0]

### Layout directives
differential pair: Adc0_Clk_n, Adc0_Clk_p, Adc0_D0_n, Adc0_D0_p, Adc0_D1_n, Adc0_D1_p, Adc0_D2_n, Adc0_D2_p, Adc0_D3_n, Adc0_D3_p, Adc0_D4_n, Adc0_D4_p, Adc0_D5_n, Adc0_D5_p, Adc0_D6_n, Adc0_D6_p, Adc0_D7_n, Adc0_D7_p, Adc0_Dco_n, Adc0_Dco_p, Adc0_Fco_n, Adc0_Fco_p, Adc1_Clk_n, Adc1_Clk_p, Adc1_D0_n, Adc1_D0_p, Adc1_D1_n, Adc1_D1_p, Adc1_D2_n, Adc1_D2_p, Adc1_D3_n, Adc1_D3_p, Adc1_D4_n, Adc1_D4_p, Adc1_D5_n, Adc1_D5_p, Adc1_D6_n, Adc1_D6_p, Adc1_D7_n, Adc1_D7_p, Adc1_Dco_n, Adc1_Dco_p, Adc1_Fco_n, Adc1_Fco_p, Adc2_Clk_n, Adc2_Clk_p, Adc2_D0_n, Adc2_D0_p, Adc2_D1_n, Adc2_D1_p, Adc2_D2_n, Adc2_D2_p, Adc2_D3_n, Adc2_D3_p, Adc2_D4_n, Adc2_D4_p, Adc2_D5_n, Adc2_D5_p, Adc2_D6_n, Adc2_D6_p, Adc2_D7_n, Adc2_D7_p, Adc2_Dco_n, Adc2_Dco_p, Adc2_Fco_n, Adc2_Fco_p, Adc3_Clk_n, Adc3_Clk_p, Adc3_D0_n, Adc3_D0_p, Adc3_D1_n, Adc3_D1_p, Adc3_D2_n, Adc3_D2_p, Adc3_D3_n, Adc3_D3_p, Adc3_D4_n, Adc3_D4_p, Adc3_D5_n, Adc3_D5_p, Adc3_D6_n, Adc3_D6_p, Adc3_D7_n, Adc3_D7_p, Adc3_Dco_n, Adc3_Dco_p, Adc3_Fco_n, Adc3_Fco_p, ClkGen_RefClock_n, ClkGen_RefClock_p, Hit_n, Hit_p, Reserved_n, Reserved_p, Strobe_n, Strobe_p

### Notes on the sheet
- close to receiver
- Модуль регистрации - цифровая часть

## Sheet Misc.SchDoc
size A3; PageSetup: Record=PageOptions|CenterHorizontal=True|CenterVertical=True|PrintScale=0.96|XCorrection=1.00|YCorrection=1.00|PrintKind=2|BorderSize=5000000|LeftOffset=0|BottomOffset=0|Orientation=2|PaperLength=1000|PaperWidth=1000|Scale=100|PaperSource=7|PrintQuality=-4|MediaType=1|DitherType=10|PaperKind=A4|PrintScaleMode=1
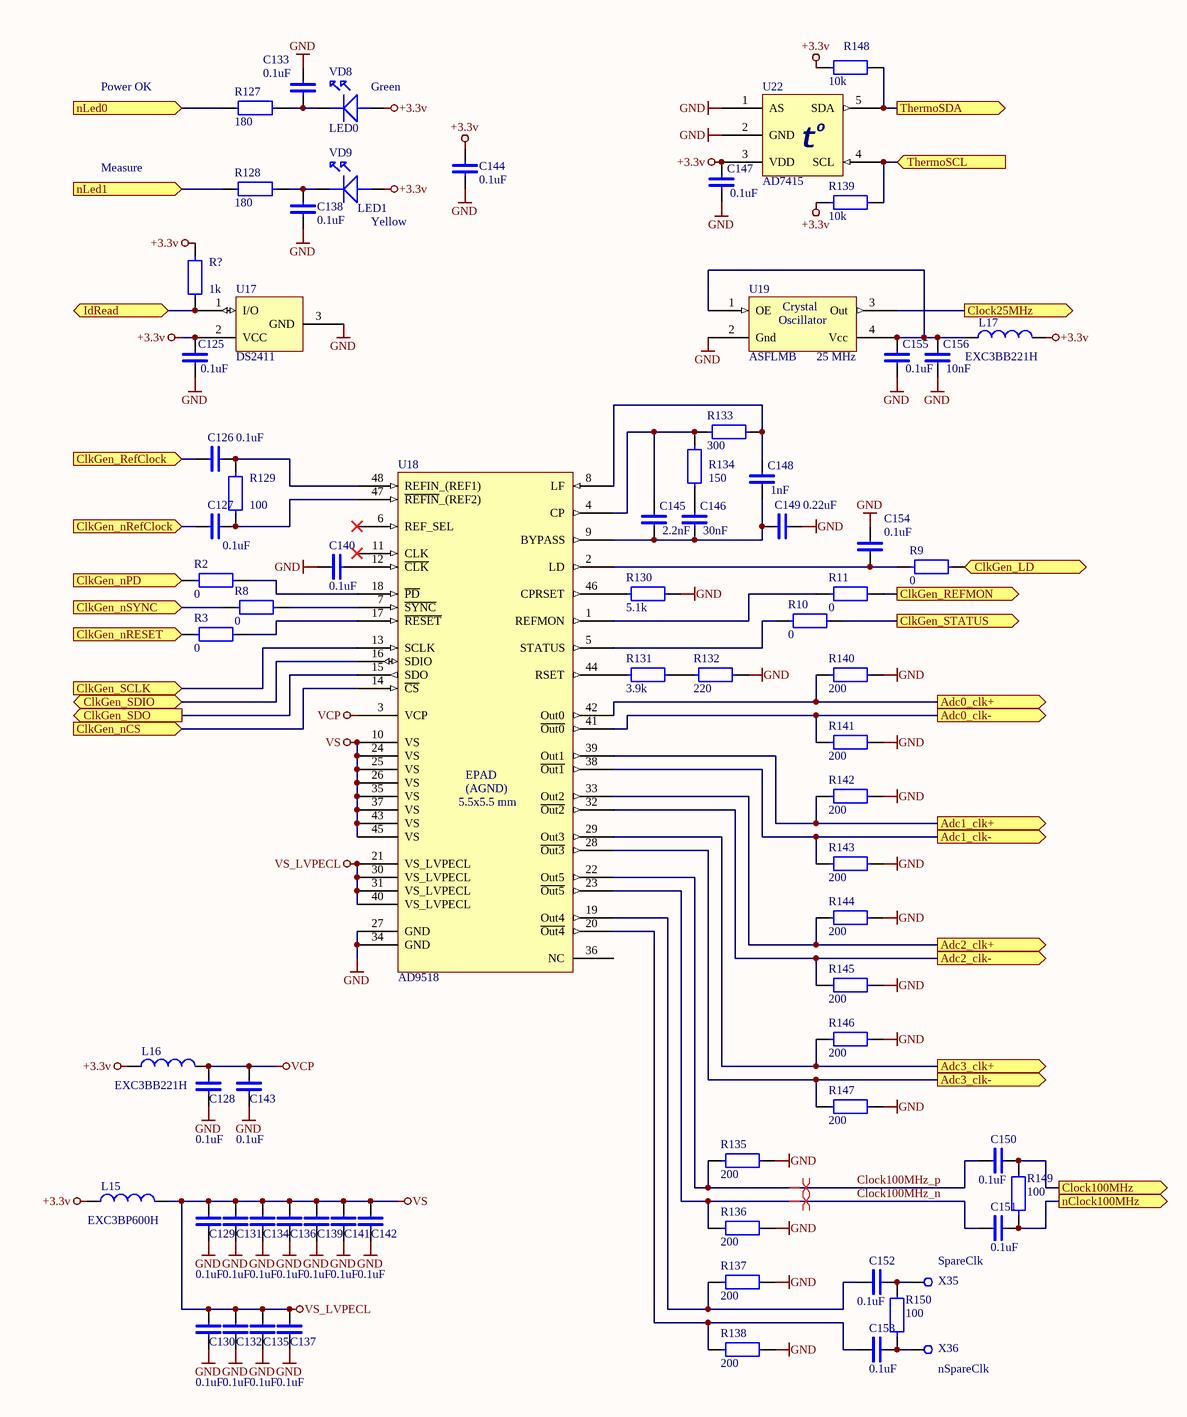
[diagram p2: Misc.SchDoc]

### Parts
C125  0.1uF  [0603]
C126  0.1uF  [0402]
C127  0.1uF  [0402]
C128  0.1uF  [0402]
C129  0.1uF  [0402]
C130  0.1uF  [0402]
C131  0.1uF  [0402]
C132  0.1uF  [0402]
C133  0.1uF  [0603]
C134  0.1uF  [0402]
C135  0.1uF  [0402]
C136  0.1uF  [0402]
C137  0.1uF  [0402]
C138  0.1uF  [0603]
C139  0.1uF  [0402]
C140  0.1uF  [0402]
C141  0.1uF  [0402]
C142  0.1uF  [0402]
C143  0.1uF  [0402]
C144  0.1uF  [0603]
C145  2.2nF  [0603]
C146  30nF  [0603]
C147  0.1uF  [0603]
C148  1nF  [0603]
C149  0.22uF  [0603]
C150  0.1uF  [0402]
C151  0.1uF  [0402]
C152  0.1uF  [0402]
C153  0.1uF  [0402]
C154  0.1uF  [0603]
C155  0.1uF  [0603]
C156  10nF  [0603]
L15  EXC3BP600H  [0603]
L16  EXC3BB221H  [0603]
L17  EXC3BB221H  [0603]
R2  0  [0603]
R3  0  [0603]
R8  0  [0603]
R9  0  [0603]
R10  0  [0603]
R11  0  [0603]
R127  180  [0805]
R128  180  [0805]
R129  100  [0402]
R130  5.1k  [0603]
R131  3.9k  [0603]
R132  220  [0603]
R133  300  [0603]
R134  150  [0603]
R135  200  [0603]
R136  200  [0603]
R137  200  [0603]
R138  200  [0603]
R139  10k  [0603]
R140  200  [0603]
R141  200  [0603]
R142  200  [0603]
R143  200  [0603]
R144  200  [0603]
R145  200  [0603]
R146  200  [0603]
R147  200  [0603]
R148  10k  [0603]
R149  100  [0402]
R150  100  [0402]
R?  1k  [0402]
U17  DS2411  [SOT-23]
U18  AD9518  [48LFCSP]
U19  ASFLMB  [KXO-V99]
U22  AD7415  [SOT-23-5]
VD8  LED0  [LED2]
VD9  LED1  [LED2]
X35  SpareClk  [DRL06]
X36  nSpareClk  [DRL06]

### Ports
Adc0_clk+ (out), Adc0_clk- (out), Adc1_clk+ (out), Adc1_clk- (out), Adc2_clk+ (out), Adc2_clk- (out), Adc3_clk+ (out), Adc3_clk- (out), ClkGen_LD (out), ClkGen_nCS (in), ClkGen_nPD (in), ClkGen_nRefClock (in), ClkGen_nRESET (in), ClkGen_nSYNC (in), ClkGen_RefClock (in), ClkGen_REFMON (out), ClkGen_SCLK (in), ClkGen_SDIO (bidir), ClkGen_SDO (out), ClkGen_STATUS (out), Clock25MHz (out), Clock100MHz (out), IdRead (bidir), nClock100MHz (out), nLed0 (in), nLed1 (in), ThermoSCL (in), ThermoSDA (out)

### Nets
+3.3v: C125.2 C144.1 C147.2 L15.1 L16.1 L17.2 R139.2 R148.2 R?.2 U17.2(VCC) U22.3(VDD) VD8.ANODE VD9.ANODE
GND: C125.1 C128.1 C129.1 C130.1 C131.1 C132.1 C133.1 C134.1 C135.1 C136.1 C137.1 C138.2 C139.1 C140.1 C141.1 C142.1 C143.1 C144.2 C147.1 C149.1 C154.1 C155.1 C156.1 R130.1 R132.1 R135.1 R136.1 R137.1 R138.1 R140.1 R141.1 R142.1 R143.1 R144.1 R145.1 R146.1 R147.1 U17.3(GND) U18.27(GND) U18.34(GND) U19.2(Gnd) U22.1(AS) U22.2(GND)  [project net C_L1-PhD1]
VCP: C128.2 C143.2 L16.2 U18.3(VCP)
VS: C129.2 C130.2 C131.2 C132.2 C134.2 C135.2 C136.2 C137.2 C139.2 C141.2 C142.2 L15.2 U18.10(VS) U18.21(VS_LVPECL) U18.24(VS) U18.25(VS) U18.26(VS) U18.30(VS_LVPECL) U18.31(VS_LVPECL) U18.35(VS) U18.37(VS) U18.40(VS_LVPECL) U18.43(VS) U18.45(VS)  [also labelled VS_LVPECL]
Adc0_Clk_n: R141.2 U18.41(~{Out0}) ; port Adc0_clk-
Adc0_Clk_p: R140.2 U18.42(Out0) ; port Adc0_clk+
Adc1_Clk_n: R143.2 U18.38(~{Out1}) ; port Adc1_clk-
Adc1_Clk_p: R142.2 U18.39(Out1) ; port Adc1_clk+
Adc2_Clk_n: R145.2 U18.32(~{Out2}) ; port Adc2_clk-
Adc2_Clk_p: R144.2 U18.33(Out2) ; port Adc2_clk+
Adc3_Clk_n: R147.2 U18.28(~{Out3}) ; port Adc3_clk-
Adc3_Clk_p: R146.2 U18.29(Out3) ; port Adc3_clk+
ClkGen_LD: R9.1 ; port ClkGen_LD
ClkGen_nCS: U18.14(~{CS}) ; port ClkGen_nCS
ClkGen_nPD: R2.2 ; port ClkGen_nPD
ClkGen_nRESET: R3.2 ; port ClkGen_nRESET
ClkGen_nSYNC: R8.2 ; port ClkGen_nSYNC
ClkGen_RefClock_n: C127.2 ; port ClkGen_nRefClock
ClkGen_RefClock_p: C126.2 ; port ClkGen_RefClock
ClkGen_REFMON: R11.1 ; port ClkGen_REFMON
ClkGen_SCLK: U18.13(SCLK) ; port ClkGen_SCLK
ClkGen_SDIO: U18.16(SDIO) ; port ClkGen_SDIO
ClkGen_SDO: U18.15(SDO) ; port ClkGen_SDO
ClkGen_STATUS: R10.1 ; port ClkGen_STATUS
Clock25MHz: U19.3(Out) ; port Clock25MHz
Clock100MHz: C150.2 R149.1 ; port Clock100MHz
Clock100MHz_n: C151.1 R136.2 U18.23(~{Out5})
Clock100MHz_p: C150.1 R135.2 U18.22(Out5)
IdRead: R?.1 U17.1(I/O) ; port IdRead
nClock100MHz: C151.2 R149.2 ; port nClock100MHz
nLed0: R127.1 ; port nLed0
nLed1: R128.1 ; port nLed1
ThermoSCL: R139.1 U22.4(SCL) ; port ThermoSCL
ThermoSDA: R148.1 U22.5(SDA) ; port ThermoSDA
NetC126_1: C126.1 R129.2 U18.48(REFIN_(REF1))
NetC127_1: C127.1 R129.1 U18.47(~{REFIN}_(REF2))
NetC133_2: C133.2 R127.2 VD8.CATHODE
NetC138_1: C138.1 R128.2 VD9.CATHODE
NetC140_2: C140.2 U18.12(~{CLK})
NetC145_1: C145.1 C146.1 C148.1 C149.2 U18.9(BYPASS)
NetC145_2: C145.2 R133.2 R134.2 U18.4(CP)
NetC146_2: C146.2 R134.1
NetC148_2: C148.2 R133.1 U18.8(LF)
NetC152_1: C152.1 R137.2 U18.19(Out4)
NetC152_2: C152.2 R150.1 X35.DRIL
NetC153_1: C153.1 R138.2 U18.20(~{Out4})
NetC153_2: C153.2 R150.2 X36.DRIL
NetC154_2: C154.2 R9.2 U18.2(LD)
NetC155_2: C155.2 C156.2 L17.1 U19.1(OE) U19.4(Vcc)
NetR2_1: R2.1 U18.18(~{PD})
NetR3_1: R3.1 U18.17(~{RESET})
NetR8_1: R8.1 U18.7(~{SYNC})
NetR10_2: R10.2 U18.5(STATUS)
NetR11_2: R11.2 U18.1(REFMON)
NetR130_2: R130.2 U18.46(CPRSET)
NetR131_1: R131.1 R132.2
NetR131_2: R131.2 U18.44(RSET)

Not connected (* = marked no-connect by the designer): U18 6(REF_SEL)* 11(CLK)* 36(NC)

### Layout directives
differential pair: Clock100MHz_n, Clock100MHz_p

### Notes on the sheet
- Power OK
- (near VD8) Green
- Measure
- (near VD9) Yellow
- (near U19) 25 MHz
- (in symbol AD7415) o; t
- (in symbol AD9518) EPAD; (AGND); 5.5x5.5 mm
- (in symbol ASFLMB) Crystal; Oscillator

### Library data of the parts
C125 C128-C149 C154-C156 = C
C126 C127 C150-C153 = c
L15-L17 = INDUCTOR
R2 R3 R8-R11 R129-R150 R? = r
R127 R128 = R
U17 = DS2411: Silicon Serial Number
U18 = AD9518: 6-Output Clock Generator with  Integrated 1.6 GHz VCO
U19 = ASFLMB: Crystal Oscillator (SMD)
U22 = AD7415: 10-Bit Digital Temperature Sensors
VD8 = LED1
X35 X36 = DRL

## Sheet PowerMeasure.SchDoc
size 218 x 162 mm; PageSetup: Record=PageOptions|CenterHorizontal=True|CenterVertical=True|PrintScale=1.22|XCorrection=1.00|YCorrection=1.00|PrintKind=2|BorderSize=5000000|LeftOffset=0|BottomOffset=0|Orientation=2|PaperLength=1000|PaperWidth=1000|Scale=100|PaperSource=7|PrintQuality=-4|MediaType=1|DitherType=10|PaperKind=A4|PrintScaleMode=1
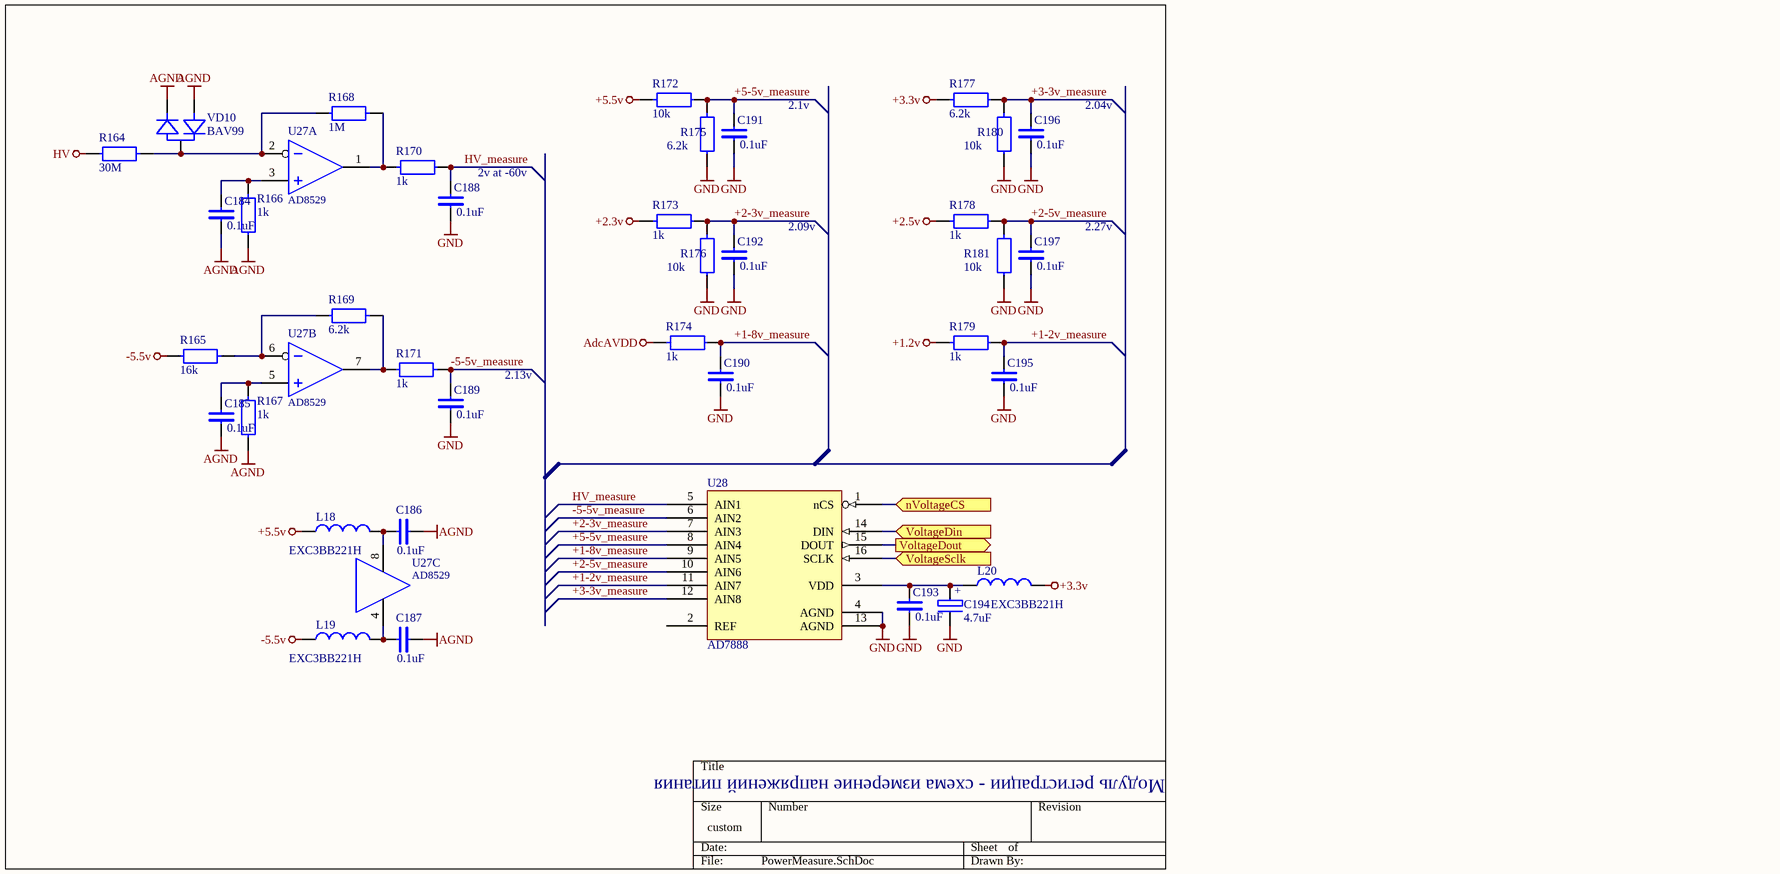
[diagram p3: PowerMeasure.SchDoc]

### Parts
C184  0.1uF  [0603]
C185  0.1uF  [0603]
C186  0.1uF  [0603]
C187  0.1uF  [0603]
C188  0.1uF  [0603]
C189  0.1uF  [0603]
C190  0.1uF  [0603]
C191  0.1uF  [0603]
C192  0.1uF  [0603]
C193  0.1uF  [0603]
C194  4.7uF  [CP3216]
C195  0.1uF  [0603]
C196  0.1uF  [0603]
C197  0.1uF  [0603]
L18  EXC3BB221H  [0603]
L19  EXC3BB221H  [0603]
L20  EXC3BB221H  [0603]
R164  30M  [0805]
R165  16k  [0805]
R166  1k  [0603]
R167  1k  [0603]
R168  1M  [0805]
R169  6.2k  [0805]
R170  1k  [0603]
R171  1k  [0603]
R172  10k  [0603]
R173  1k  [0603]
R174  1k  [0603]
R175  6.2k  [0805]
R176  10k  [0603]
R177  6.2k  [0805]
R178  1k  [0603]
R179  1k  [0603]
R180  10k  [0603]
R181  10k  [0603]
U27  AD8529  [8SOIC150]  (parts A,B,C of 3)
U28  AD7888  [16SOIC150]
VD10  BAV99  [SOT-23]

### Ports
nVoltageCS (in), VoltageDin (in), VoltageDout (out), VoltageSclk (in)

### Nets
+1.2v: R179.2
+2.3v: R173.2
+2.5v: R178.2
+3.3v: L20.2 R177.2
+5.5v: L18.1 R172.2
-5.5v: L19.1 R165.1
AdcAVDD: R174.2
AGND: C184.1 C185.1 C186.1 C187.1 C188.1 C189.1 C190.1 C191.1 C192.1 C193.1 C194.- C195.1 C196.1 C197.1 R166.1 R167.1 R175.1 R176.1 R180.1 R181.1 U28.4(AGND) U28.13(AGND) VD10.1 VD10.2  [also labelled GND]  [project net C_L1-PhD1]
HV: R164.1
+1-2v_measure: C195.2 R179.1 U28.11(AIN7)
+1-8v_measure: C190.2 R174.1 U28.9(AIN5)
+2-3v_measure: C192.2 R173.1 R176.2 U28.7(AIN3)
+2-5v_measure: C197.2 R178.1 R181.2 U28.10(AIN6)
+3-3v_measure: C196.2 R177.1 R180.2 U28.12(AIN8)
+5-5v_measure: C191.2 R172.1 R175.2 U28.8(AIN4)
-5-5v_measure: C189.2 R171.2 U28.6(AIN2)
HV_measure: C188.2 R170.1 U28.5(AIN1)
nVoltageCS: U28.1(nCS) ; port nVoltageCS
VoltageDin: U28.14(DIN) ; port VoltageDin
VoltageDout: U28.15(DOUT) ; port VoltageDout
VoltageSclk: U28.16(SCLK) ; port VoltageSclk
NetC184_2: C184.2 R166.2 U27.3(IN+)
NetC185_2: C185.2 R167.2 U27.5(IN+)
NetC186_2: C186.2 L18.2 U27.8(V+)
NetC187_2: C187.2 L19.2 U27.4(V-)
NetC193_2: C193.2 C194.+ L20.1 U28.3(VDD)
NetR164_2: R164.2 R168.1 U27.2(IN-) VD10.3
NetR165_2: R165.2 R169.1 U27.6(IN-)
NetR168_2: R168.2 R170.2 U27.1(OUT)
NetR169_2: R169.2 R171.1 U27.7(OUT)

Not connected (* = marked no-connect by the designer): U28 2(REF)

### Notes on the sheet
- 2.1v
- 2.04v
- 2v at -60v
- 2.09v
- 2.27v
- 2.13v
- Модуль регистрации - схема измерение напряжений питания

### Library data of the parts
C184 C185 C188-C193 C195-C197 = C
C186 C187 = c
C194 = C POL
L18-L20 = INDUCTOR
R164-R169 = r
R170-R181 = R
U27 = AD8529: 8 MHz Rail-to-Rail Operational Amplifiers; Value: AD8529
U28 = AD7888: 8-Channel, 125 kSPS, 12-Bit ADC; BodyName: *; Instance: *; PartName: *; PLACEMENT_REGION: *; CompValue: *; Right: *; Bottom: *; SymName: *; RefLocation: *; BoardLocation: *; SlotXofY: *
VD10 = BAV99: Double diode

## Sheet Memory.SchDoc
size A4; PageSetup: Record=PageOptions|CenterHorizontal=True|CenterVertical=True|PrintScale=0.96|XCorrection=1.00|YCorrection=1.00|PrintKind=2|BorderSize=5000000|LeftOffset=0|BottomOffset=0|Orientation=2|PaperLength=1000|PaperWidth=1000|Scale=100|PaperSource=7|PrintQuality=-4|MediaType=1|DitherType=10|PaperKind=A4|PrintScaleMode=1
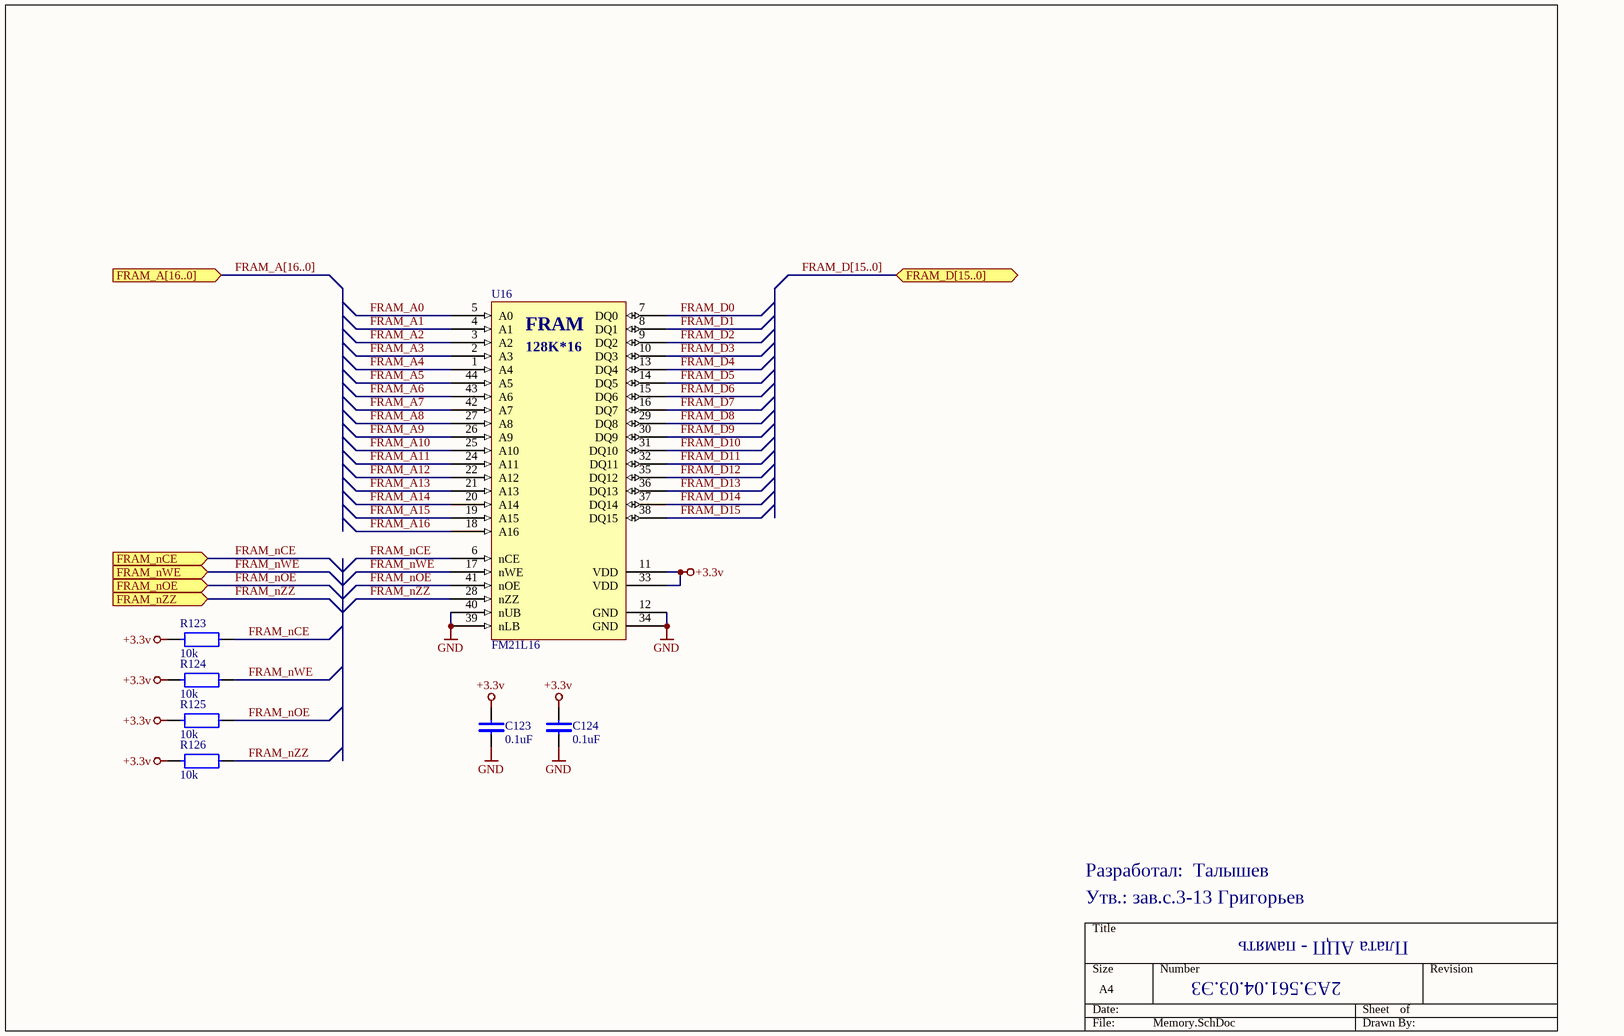
[diagram p4: Memory.SchDoc]

### Parts
C123  0.1uF  [0603]
C124  0.1uF  [0603]
R123  10k  [0603]
R124  10k  [0603]
R125  10k  [0603]
R126  10k  [0603]
U16  FM21L16  [TSOP-II-44]

### Ports
FRAM_A[16..0] (in), FRAM_D[15..0] (bidir), FRAM_nCE (in), FRAM_nOE (in), FRAM_nWE (in), FRAM_nZZ (in)

### Nets
+3.3v: C123.2 C124.2 R123.2 R124.2 R125.2 R126.2 U16.11(VDD) U16.33(VDD)
GND: C123.1 C124.1 U16.12(GND) U16.34(GND) U16.39(nLB) U16.40(nUB)  [project net C_L1-PhD1]
FRAM_A0: U16.5(A0)
FRAM_A1: U16.4(A1)
FRAM_A2: U16.3(A2)
FRAM_A3: U16.2(A3)
FRAM_A4: U16.1(A4)
FRAM_A5: U16.44(A5)
FRAM_A6: U16.43(A6)
FRAM_A7: U16.42(A7)
FRAM_A8: U16.27(A8)
FRAM_A9: U16.26(A9)
FRAM_A10: U16.25(A10)
FRAM_A11: U16.24(A11)
FRAM_A12: U16.22(A12)
FRAM_A13: U16.21(A13)
FRAM_A14: U16.20(A14)
FRAM_A15: U16.19(A15)
FRAM_A16: U16.18(A16)
FRAM_D0: U16.7(DQ0)
FRAM_D1: U16.8(DQ1)
FRAM_D2: U16.9(DQ2)
FRAM_D3: U16.10(DQ3)
FRAM_D4: U16.13(DQ4)
FRAM_D5: U16.14(DQ5)
FRAM_D6: U16.15(DQ6)
FRAM_D7: U16.16(DQ7)
FRAM_D8: U16.29(DQ8)
FRAM_D9: U16.30(DQ9)
FRAM_D10: U16.31(DQ10)
FRAM_D11: U16.32(DQ11)
FRAM_D12: U16.35(DQ12)
FRAM_D13: U16.36(DQ13)
FRAM_D14: U16.37(DQ14)
FRAM_D15: U16.38(DQ15)
FRAM_nCE: R123.1 U16.6(nCE) ; port FRAM_nCE
FRAM_nOE: R125.1 U16.41(nOE) ; port FRAM_nOE
FRAM_nWE: R124.1 U16.17(nWE) ; port FRAM_nWE
FRAM_nZZ: R126.1 U16.28(nZZ) ; port FRAM_nZZ

### Buses and harness runs
bus FRAM_A[16..0] = port FRAM_A[16..0]
bus FRAM_D[15..0] = port FRAM_D[15..0]

### Notes on the sheet
- Разработал:  Талышев
- Утв.: зав.с.3-13 Григорьев
- 2АЭ.561.04.03.Э3
- Плата АЦП - память
- (in symbol FM21L16) FRAM; 128K*16

### Library data of the parts
C123 C124 = C
R123-R126 = R
U16 = FM21L16: 2Mbit (128K*16) F-RAM Memory

## Sheet ADC.SchDoc
size 342 x 203 mm; PageSetup: Record=PageOptions|CenterHorizontal=True|CenterVertical=True|PrintScale=0.96|XCorrection=1.00|YCorrection=1.00|PrintKind=2|BorderSize=5000000|LeftOffset=0|BottomOffset=0|Orientation=2|PaperLength=1000|PaperWidth=1000|Scale=100|PaperSource=7|PrintQuality=-4|MediaType=1|DitherType=10|PaperKind=A4|PrintScaleMode=1
Used 4 times, as channels DigitalPart/ADC_0, DigitalPart/ADC_1, DigitalPart/ADC_2, DigitalPart/ADC_3. Parts and nets are listed once, with the designators drawn on the sheet.
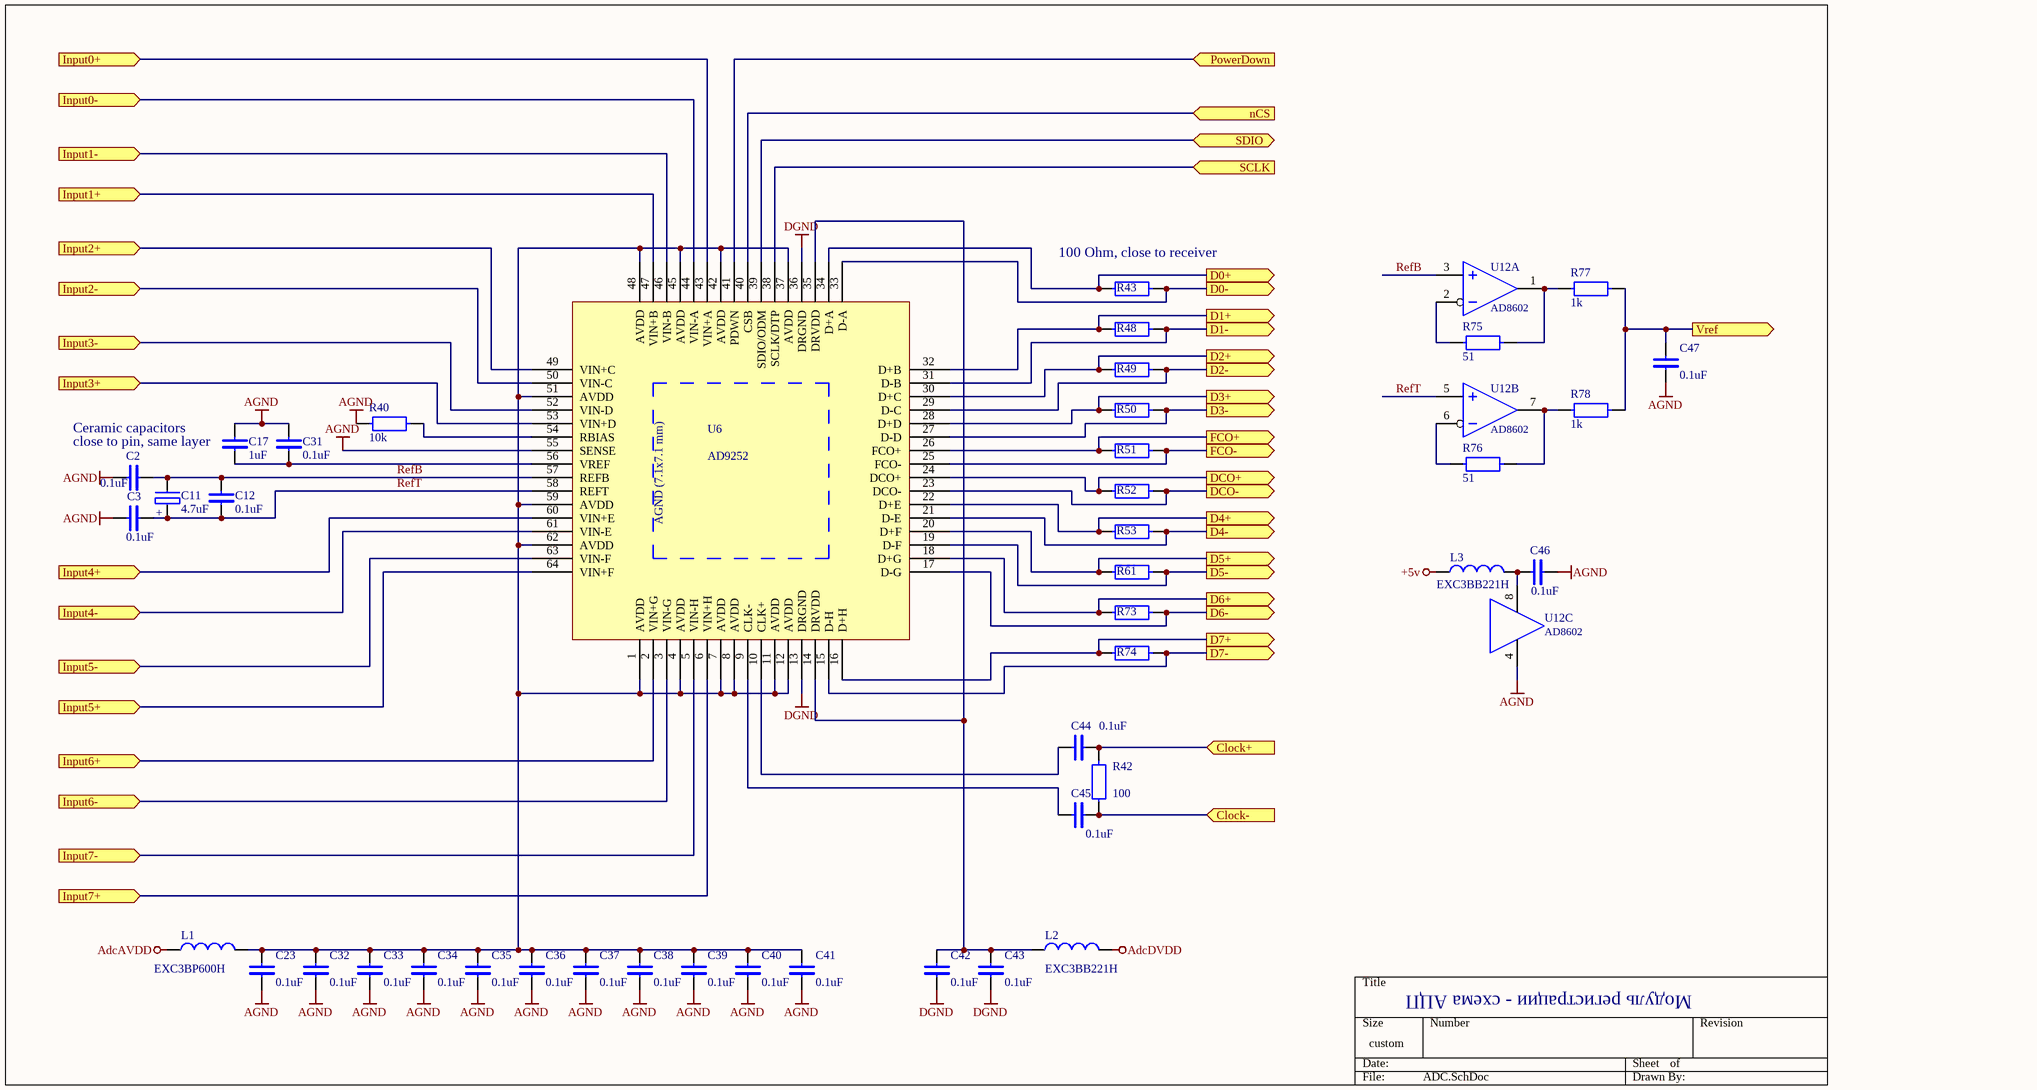
[diagram p5: ADC.SchDoc]

### Parts
C2  0.1uF  [0402]
C3  0.1uF  [0402]
C11  4.7uF  [CP3216]
C12  0.1uF  [0402]
C17  1uF  [0603]
C23  0.1uF  [0402]
C31  0.1uF  [0402]
C32  0.1uF  [0402]
C33  0.1uF  [0402]
C34  0.1uF  [0402]
C35  0.1uF  [0402]
C36  0.1uF  [0402]
C37  0.1uF  [0402]
C38  0.1uF  [0402]
C39  0.1uF  [0402]
C40  0.1uF  [0402]
C41  0.1uF  [0402]
C42  0.1uF  [0402]
C43  0.1uF  [0402]
C44  0.1uF  [0402]
C45  0.1uF  [0402]
C46  0.1uF  [0402]
C47  0.1uF  [0402]
L1  EXC3BP600H  [0603]
L2  EXC3BB221H  [0603]
L3  EXC3BB221H  [0603]
R40  10k  [0603]
R42  100  [0402]
R43  100  [0402]  (value not drawn)
R48  100  [0402]  (value not drawn)
R49  100  [0402]  (value not drawn)
R50  100  [0402]  (value not drawn)
R51  100  [0402]  (value not drawn)
R52  100  [0402]  (value not drawn)
R53  100  [0402]  (value not drawn)
R61  100  [0402]  (value not drawn)
R73  100  [0402]  (value not drawn)
R74  100  [0402]  (value not drawn)
R75  51  [0603]
R76  51  [0603]
R77  1k  [0603]
R78  1k  [0603]
U6  AD9252  [CP-64]
U12  AD8602  [8SOIC150]  (parts A,B,C of 3)

### Ports
Clock+ (in), Clock- (in), D0+ (out), D0- (out), D1+ (out), D1- (out), D2+ (out), D2- (out), D3+ (out), D3- (out), D4+ (out), D4- (out), D5+ (out), D5- (out), D6+ (out), D6- (out), D7+ (out), D7- (out), DCO+ (out), DCO- (out), FCO+ (out), FCO- (out), Input0+ (in), Input0- (in), Input1+ (in), Input1- (in), Input2+ (in), Input2- (in), Input3+ (in), Input3- (in), Input4+ (in), Input4- (in), Input5+ (in), Input5- (in), Input6+ (in), Input6- (in), Input7+ (in), Input7- (in), nCS (in), PowerDown (in), SCLK (in), SDIO (bidir), Vref (out)

### Nets
+5v: L3.1
AdcAVDD: L1.1
AdcDVDD: L2.2
AGND: C2.1 C3.2 C17.2 C23.1 C31.2 C32.1 C33.1 C34.1 C35.1 C36.1 C37.1 C38.1 C39.1 C40.1 C41.1 C46.1 C47.1 R40.1 U6.55(SENSE) U12.4(V-)
DGND: C42.1 C43.1 U6.13(DRGND) U6.36(DRGND)
Clock+: C44.1 R42.2 ; port Clock+
Clock-: C45.1 R42.1 ; port Clock-
D0+: R43.1 U6.34(D+A) ; port D0+
D0-: R43.2 U6.33(D-A) ; port D0-
D1+: R48.1 U6.32(D+B) ; port D1+
D1-: R48.2 U6.31(D-B) ; port D1-
D2+: R49.1 U6.30(D+C) ; port D2+
D2-: R49.2 U6.29(D-C) ; port D2-
D3+: R50.1 U6.28(D+D) ; port D3+
D3-: R50.2 U6.27(D-D) ; port D3-
D4+: R53.1 U6.22(D+E) ; port D4+
D4-: R53.2 U6.21(D-E) ; port D4-
D5+: R61.1 U6.20(D+F) ; port D5+
D5-: R61.2 U6.19(D-F) ; port D5-
D6+: R73.1 U6.18(D+G) ; port D6+
D6-: R73.2 U6.17(D-G) ; port D6-
D7+: R74.1 U6.16(D+H) ; port D7+
D7-: R74.2 U6.15(D-H) ; port D7-
DCO+: R52.1 U6.24(DCO+) ; port DCO+
DCO-: R52.2 U6.23(DCO-) ; port DCO-
FCO+: R51.1 U6.26(FCO+) ; port FCO+
FCO-: R51.2 U6.25(FCO-) ; port FCO-
Input0+: U6.43(VIN+A) ; port Input0+
Input0-: U6.44(VIN-A) ; port Input0-
Input1+: U6.47(VIN+B) ; port Input1+
Input1-: U6.46(VIN-B) ; port Input1-
Input2+: U6.49(VIN+C) ; port Input2+
Input2-: U6.50(VIN-C) ; port Input2-
Input3+: U6.53(VIN+D) ; port Input3+
Input3-: U6.52(VIN-D) ; port Input3-
Input4+: U6.60(VIN+E) ; port Input4+
Input4-: U6.61(VIN-E) ; port Input4-
Input5+: U6.64(VIN+F) ; port Input5+
Input5-: U6.63(VIN-F) ; port Input5-
Input6+: U6.2(VIN+G) ; port Input6+
Input6-: U6.3(VIN-G) ; port Input6-
Input7+: U6.6(VIN+H) ; port Input7+
Input7-: U6.5(VIN-H) ; port Input7-
nCS: U6.40(CSB) ; port nCS
PowerDown: U6.41(PDWN) ; port PowerDown
RefB: C2.2 C11.- C12.2 U6.57(REFB) U12.3(IN+)
RefT: C3.1 C11.+ C12.1 U6.58(REFT) U12.5(IN+)
SCLK: U6.38(SCLK/DTP) ; port SCLK
SDIO: U6.39(SDIO/ODM) ; port SDIO
Vref: C47.2 R77.2 R78.2 ; port Vref
NetC17_1: C17.1 C31.1 U6.56(VREF)
NetC23_2: C23.2 C32.2 C33.2 C34.2 C35.2 C36.2 C37.2 C38.2 C39.2 C40.2 C41.2 L1.2 U6.1(AVDD) U6.4(AVDD) U6.7(AVDD) U6.8(AVDD) U6.11(AVDD) U6.12(AVDD) U6.37(AVDD) U6.42(AVDD) U6.45(AVDD) U6.48(AVDD) U6.51(AVDD) U6.59(AVDD) U6.62(AVDD)
NetC42_2: C42.2 C43.2 L2.1 U6.14(DRVDD) U6.35(DRVDD)
NetC44_2: C44.2 U6.10(CLK+)
NetC45_2: C45.2 U6.9(CLK-)
NetC46_2: C46.2 L3.2 U12.8(V+)
NetR40_2: R40.2 U6.54(RBIAS)
NetR75_1: R75.1 U12.2(IN-)
NetR75_2: R75.2 R77.1 U12.1(OUT)
NetR76_1: R76.1 U12.6(IN-)
NetR76_2: R76.2 R78.1 U12.7(OUT)

### Channels
DigitalPart/ADC_0: designators end in _ADC_0; ports Clock+=Adc0_Clk_p Clock-=Adc0_Clk_n D0+=Adc0_D0_p D0-=Adc0_D0_n D1+=Adc0_D1_p D1-=Adc0_D1_n D2+=Adc0_D2_p D2-=Adc0_D2_n D3+=Adc0_D3_p D3-=Adc0_D3_n D4+=Adc0_D4_p D4-=Adc0_D4_n D5+=Adc0_D5_p D5-=Adc0_D5_n D6+=Adc0_D6_p D6-=Adc0_D6_n D7+=Adc0_D7_p D7-=Adc0_D7_n DCO+=Adc0_Dco_p DCO-=Adc0_Dco_n FCO+=Adc0_Fco_p FCO-=Adc0_Fco_n Input0+=Adc0_In0+ Input0-=Adc0_In0- Input1+=Adc0_In1+ Input1-=Adc0_In1- Input2+=Adc0_In2+ Input2-=Adc0_In2- Input3+=Adc0_In3+ Input3-=Adc0_In3- Input4+=Adc0_In4+ Input4-=Adc0_In4- Input5+=Adc0_In5+ Input5-=Adc0_In5- Input6+=Adc0_In6+ Input6-=Adc0_In6- Input7+=Adc0_In7+ Input7-=Adc0_In7- nCS=Adc0_nCS PowerDown=Adc_Pdwn SCLK=Adc_Sclk SDIO=Adc_Sdio Vref=Adc0_Vref
DigitalPart/ADC_1: designators end in _ADC_1; ports Clock+=Adc1_Clk_p Clock-=Adc1_Clk_n D0+=Adc1_D0_p D0-=Adc1_D0_n D1+=Adc1_D1_p D1-=Adc1_D1_n D2+=Adc1_D2_p D2-=Adc1_D2_n D3+=Adc1_D3_p D3-=Adc1_D3_n D4+=Adc1_D4_p D4-=Adc1_D4_n D5+=Adc1_D5_p D5-=Adc1_D5_n D6+=Adc1_D6_p D6-=Adc1_D6_n D7+=Adc1_D7_p D7-=Adc1_D7_n DCO+=Adc1_Dco_p DCO-=Adc1_Dco_n FCO+=Adc1_Fco_p FCO-=Adc1_Fco_n Input0+=Adc1_In0+ Input0-=Adc1_In0- Input1+=Adc1_In1+ Input1-=Adc1_In1- Input2+=Adc1_In2+ Input2-=Adc1_In2- Input3+=Adc1_In3+ Input3-=Adc1_In3- Input4+=Adc1_In4+ Input4-=Adc1_In4- Input5+=Adc1_In5+ Input5-=Adc1_In5- Input6+=Adc1_In6+ Input6-=Adc1_In6- Input7+=Adc1_In7+ Input7-=Adc1_In7- nCS=Adc1_nCS PowerDown=Adc_Pdwn SCLK=Adc_Sclk SDIO=Adc_Sdio Vref=Adc1_Vref
DigitalPart/ADC_2: designators end in _ADC_2; ports Clock+=Adc2_Clk_p Clock-=Adc2_Clk_n D0+=Adc2_D0_p D0-=Adc2_D0_n D1+=Adc2_D1_p D1-=Adc2_D1_n D2+=Adc2_D2_p D2-=Adc2_D2_n D3+=Adc2_D3_p D3-=Adc2_D3_n D4+=Adc2_D4_p D4-=Adc2_D4_n D5+=Adc2_D5_p D5-=Adc2_D5_n D6+=Adc2_D6_p D6-=Adc2_D6_n D7+=Adc2_D7_p D7-=Adc2_D7_n DCO+=Adc2_Dco_p DCO-=Adc2_Dco_n FCO+=Adc2_Fco_p FCO-=Adc2_Fco_n Input0+=Adc2_In0+ Input0-=Adc2_In0- Input1+=Adc2_In1+ Input1-=Adc2_In1- Input2+=Adc2_In2+ Input2-=Adc2_In2- Input3+=Adc2_In3+ Input3-=Adc2_In3- Input4+=Adc2_In4+ Input4-=Adc2_In4- Input5+=Adc2_In5+ Input5-=Adc2_In5- Input6+=Adc2_In6+ Input6-=Adc2_In6- Input7+=Adc2_In7+ Input7-=Adc2_In7- nCS=Adc2_nCS PowerDown=Adc_Pdwn SCLK=Adc_Sclk SDIO=Adc_Sdio Vref=Adc2_Vref
DigitalPart/ADC_3: designators end in _ADC_3; ports Clock+=Adc3_Clk_p Clock-=Adc3_Clk_n D0+=Adc3_D0_p D0-=Adc3_D0_n D1+=Adc3_D1_p D1-=Adc3_D1_n D2+=Adc3_D2_p D2-=Adc3_D2_n D3+=Adc3_D3_p D3-=Adc3_D3_n D4+=Adc3_D4_p D4-=Adc3_D4_n D5+=Adc3_D5_p D5-=Adc3_D5_n D6+=Adc3_D6_p D6-=Adc3_D6_n D7+=Adc3_D7_p D7-=Adc3_D7_n DCO+=Adc3_Dco_p DCO-=Adc3_Dco_n FCO+=Adc3_Fco_p FCO-=Adc3_Fco_n Input0+=Adc3_In0+ Input0-=Adc3_In0- Input1+=Adc3_In1+ Input1-=Adc3_In1- Input2+=Adc3_In2+ Input2-=Adc3_In2- Input3+=Adc3_In3+ Input3-=Adc3_In3- Input4+=Adc3_In4+ Input4-=Adc3_In4- Input5+=Adc3_In5+ Input5-=Adc3_In5- Input6+=Adc3_In6+ Input6-=Adc3_In6- Input7+=Adc3_In7+ Input7-=Adc3_In7- nCS=Adc3_nCS PowerDown=Adc_Pdwn SCLK=Adc_Sclk SDIO=Adc_Sdio Vref=Adc3_Vref

### Notes on the sheet
- (near R43) 100 Ohm, close to receiver
- Ceramic capacitors
- (near C17) close to pin, same layer
- Модуль регистрации - схема АЦП
- (in symbol AD9252) AGND (7.1x7.1 mm)

### Library data of the parts
C2 C3 C12 C17 C23 C31-C47 = c
C11 = c+
L1-L3 = INDUCTOR
R40 R42 R43 R48-R53 R61 R73-R78 = r
U6 = AD9252: Octal, 14-bit, 50 MSPS, Serial LVDS, 1.8V ADC
U12 = AD8602: 8 MHz Rail-to-Rail Operational Amplifiers; Value: AD8602

## Sheet Power.SchDoc
size A4; PageSetup: Record=PageOptions|CenterHorizontal=True|CenterVertical=True|PrintScale=1.22|XCorrection=1.00|YCorrection=1.00|PrintKind=2|BorderSize=5000000|LeftOffset=0|BottomOffset=0|Orientation=2|PaperLength=1000|PaperWidth=1000|Scale=100|PaperSource=7|PrintQuality=-4|MediaType=1|DitherType=10|PaperKind=A4|PrintScaleMode=1
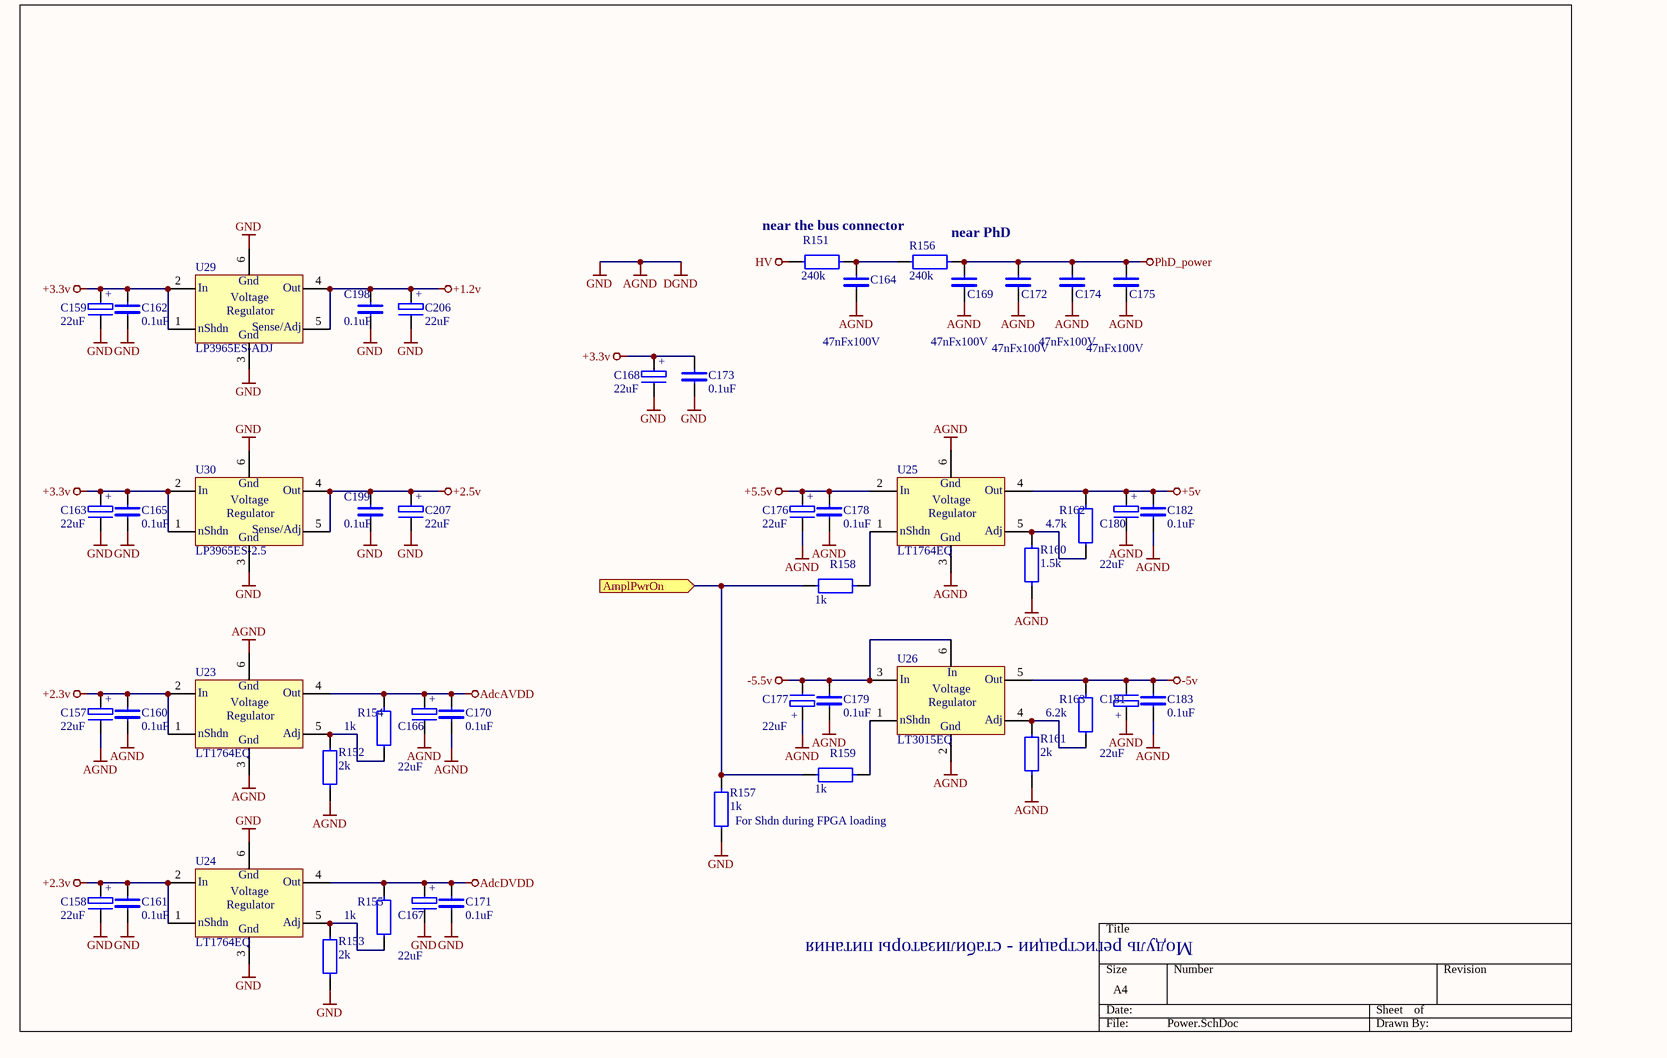
[diagram p6: Power.SchDoc]

### Parts
C157  22uF  [CP6032]
C158  22uF  [CP6032]
C159  22uF  [CP6032]
C160  0.1uF  [0603]
C161  0.1uF  [0603]
C162  0.1uF  [0603]
C163  22uF  [CP6032]
C164  47nFx100V  [1206]
C165  0.1uF  [0603]
C166  22uF  [CP6032]
C167  22uF  [CP6032]
C168  22uF  [CP6032]
C169  47nFx100V  [1206]
C170  0.1uF  [0603]
C171  0.1uF  [0603]
C172  47nFx100V  [1206]
C173  0.1uF  [0603]
C174  47nFx100V  [1206]
C175  47nFx100V  [1206]
C176  22uF  [CP6032]
C177  22uF  [CP6032]
C178  0.1uF  [0603]
C179  0.1uF  [0603]
C180  22uF  [CP6032]
C181  22uF  [CP6032]
C182  0.1uF  [0603]
C183  0.1uF  [0603]
C198  0.1uF  [0603]
C199  0.1uF  [0603]
C206  22uF  [CP6032]
C207  22uF  [CP6032]
R151  240k  [0805]
R152  2k  [0603]
R153  2k  [0603]
R154  1k  [0603]
R155  1k  [0603]
R156  240k  [0805]
R157  1k  [0603]
R158  1k  [0603]
R159  1k  [0603]
R160  1.5k  [0603]
R161  2k  [0603]
R162  4.7k  [0805]
R163  6.2k  [0805]
U23  LT1764EQ  [TO-263-5]
U24  LT1764EQ  [TO-263-5]
U25  LT1764EQ  [TO-263-5]
U26  LT3015EQ  [TO-263-5]
U29  LP3965ES-ADJ  [TO-263-5]
U30  LP3965ES-2.5  [TO-263-5]

### Ports
AmplPwrOn (in)

### Nets
+1.2v: C198.2 C206.+ U29.4(Out) U29.5(SENSE/ADJ)
+2.3v: C157.+ C158.+ C160.2 C161.2 U23.1(nSHDN) U23.2(In) U24.1(nSHDN) U24.2(In)
+2.5v: C199.2 C207.+ U30.4(Out) U30.5(SENSE/ADJ)
+3.3v: C159.+ C162.2 C163.+ C165.2 C168.+ C173.2 U29.1(nSHDN) U29.2(In) U30.1(nSHDN) U30.2(In)
+5.5v: C176.+ C178.2 U25.2(In)
+5v: C180.+ C182.2 R162.2 U25.4(Out)
-5.5v: C177.- C179.2 U26.3(In) U26.6(Substrate)
-5v: C181.- C183.2 R163.2 U26.5(Out)
AdcAVDD: C166.+ C170.2 R154.2 U23.4(Out)
AdcDVDD: C167.+ C171.2 R155.2 U24.4(Out)
AGND: C157.- C158.- C159.- C160.1 C161.1 C162.1 C163.- C164.1 C165.1 C166.- C167.- C168.- C169.1 C170.1 C171.1 C172.1 C173.1 C174.1 C175.1 C176.- C177.+ C178.1 C179.1 C180.- C181.+ C182.1 C183.1 C198.1 C199.1 C206.- C207.- R152.2 R153.2 R157.1 R160.2 R161.2 U23.3(GND) U23.6(Substrate) U24.3(GND) U24.6(Substrate) U25.3(GND) U25.6(Substrate) U26.2(GND) U29.3(GND) U29.6(Substrate) U30.3(GND) U30.6(Substrate)  [also labelled DGND, GND]  [project net C_L1-PhD1]
HV: R151.1
PhD_power: C169.2 C172.2 C174.2 C175.2 R156.2
AmplPwrOn: R157.2 R158.1 R159.1 ; port AmplPwrOn
NetC164_2: C164.2 R151.2 R156.1
NetR152_1: R152.1 R154.1 U23.5(SENSE/ADJ)
NetR153_1: R153.1 R155.1 U24.5(SENSE/ADJ)
NetR158_2: R158.2 U25.1(nSHDN)
NetR159_2: R159.2 U26.1(nSHDN)
NetR160_1: R160.1 R162.1 U25.5(SENSE/ADJ)
NetR161_1: R161.1 R163.1 U26.4(SENSE/ADJ)

### Notes on the sheet
- near the bus connector
- near PhD
- (near R157) For Shdn during FPGA loading
- Модуль регистрации - стабилизаторы питания
- (in symbol LP3965) Gnd; Voltage; Regulator; nShdn; Sense/Adj
- (in symbol LT1764) Gnd; Voltage; Regulator; nShdn; Adj
- (in symbol LT3015) Voltage; Regulator; nShdn; Adj; Gnd

### Library data of the parts
C157-C159 C163 C166-C168 C176 C177 C180 C181 C206 C207 = C POL
C160-C162 C164 C165 C169-C175 C178 C179 C182 C183 C198 C199 = C
R151-R163 = R
U23-U25 = LT1764: Positive Linear Regulators with On/Off
U26 = LT3015: Negative Linear Regulators with On/Off
U29 U30 = LP3965: Positive Linear Regulators with On/Off